# Altium schematic sheet demo_dermis_main_testboard_scratch.SchDoc
size A0
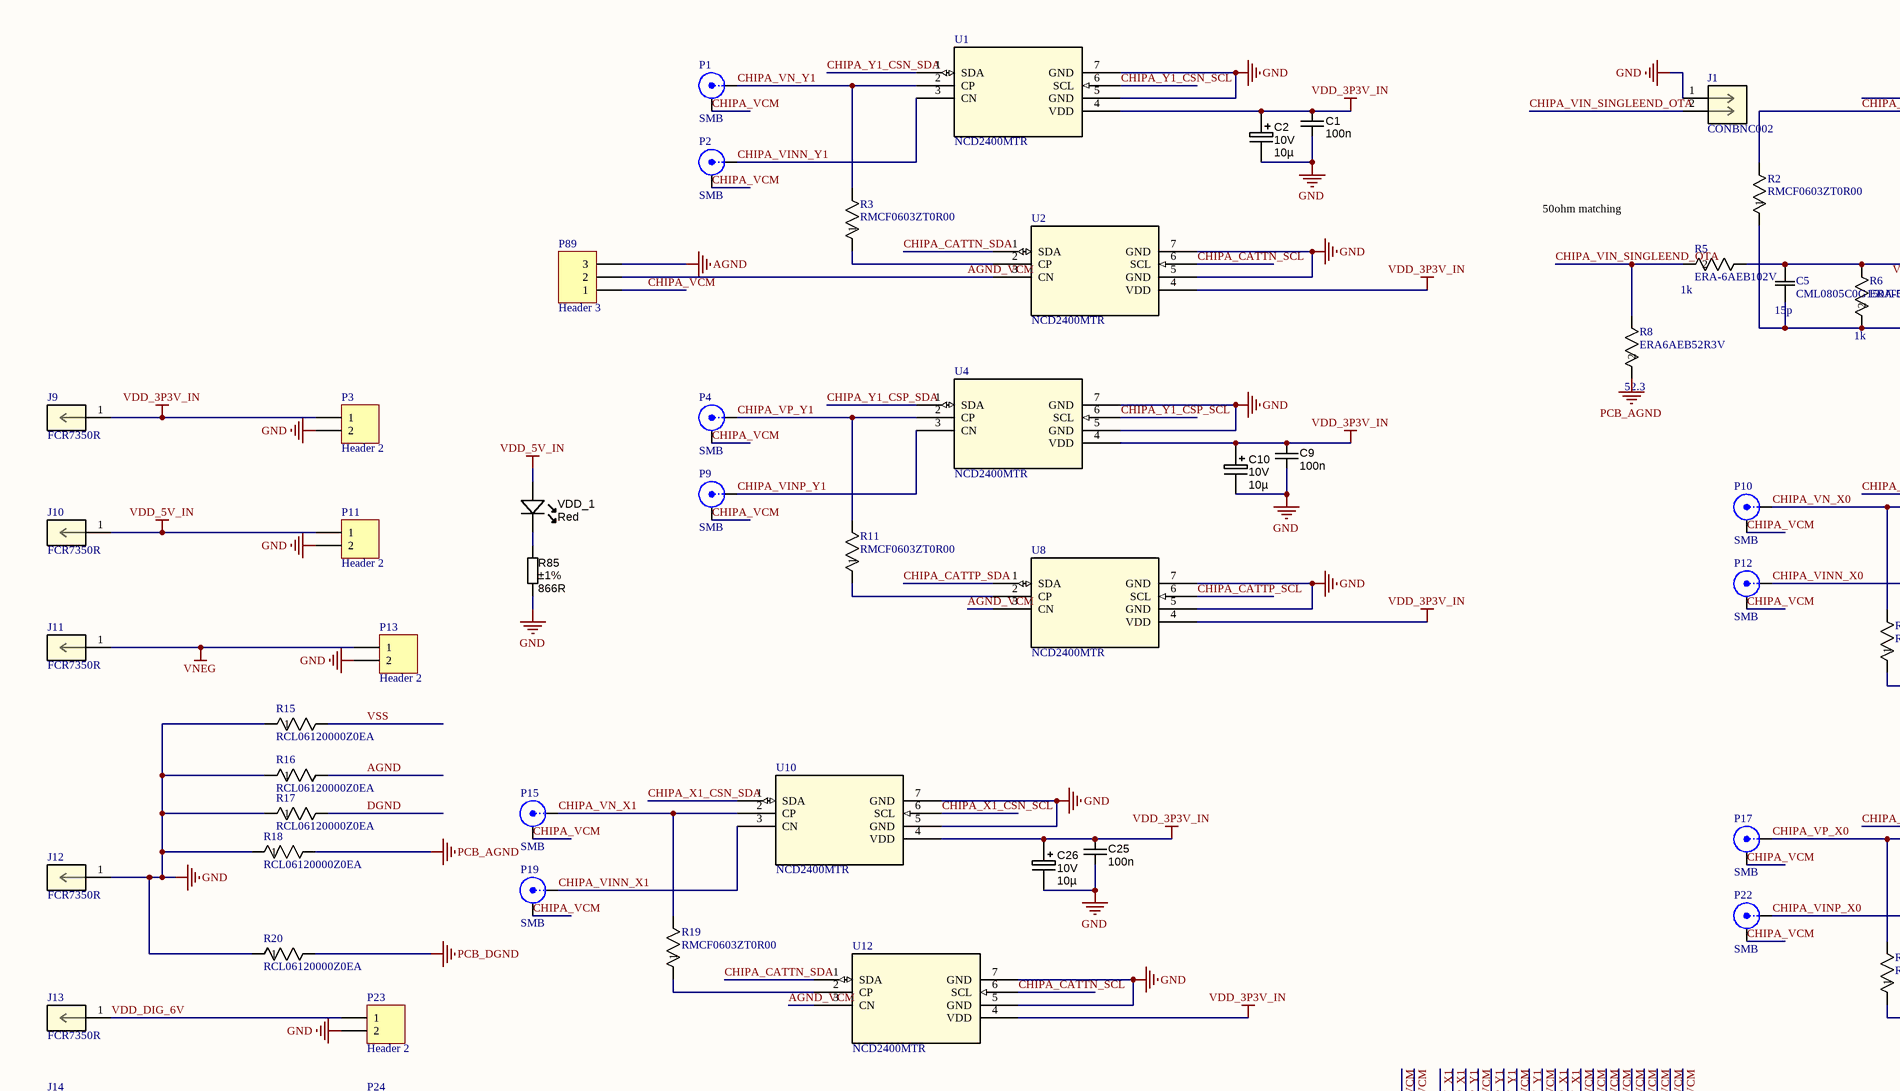
[diagram p0: demo_dermis_main_testboard_scratch.SchDoc, top left]
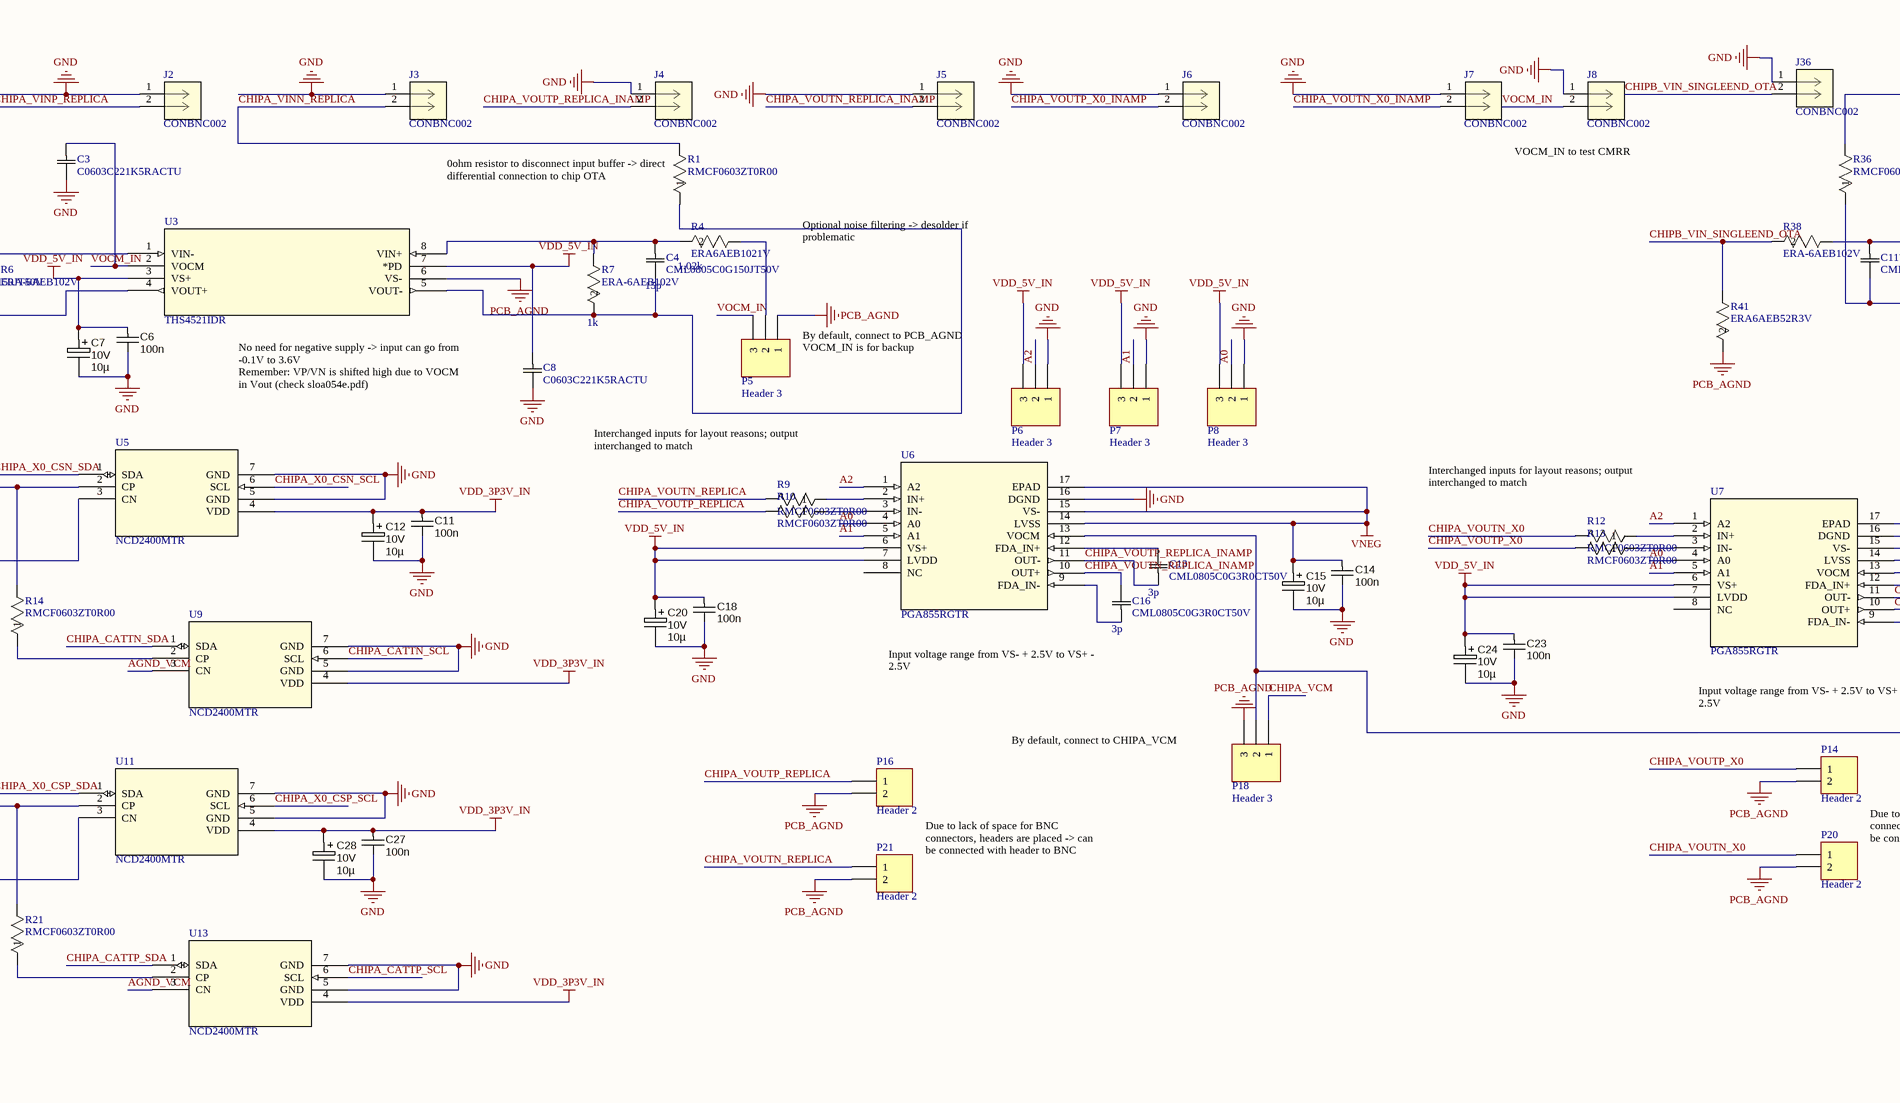
[diagram p1: demo_dermis_main_testboard_scratch.SchDoc, top middle]
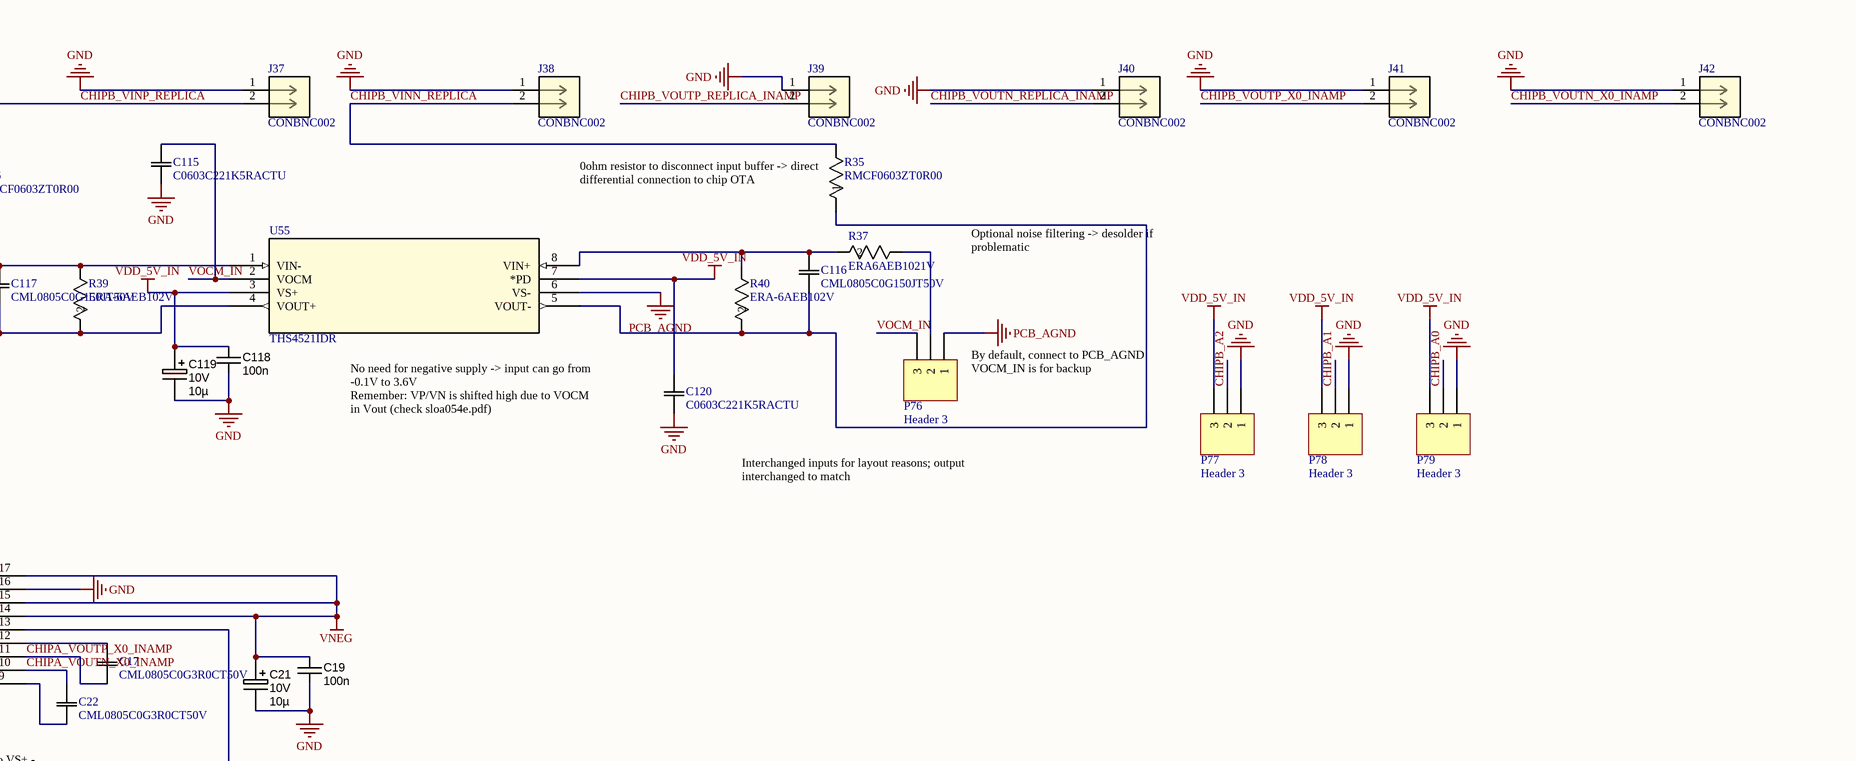
[diagram p2: demo_dermis_main_testboard_scratch.SchDoc, top right]
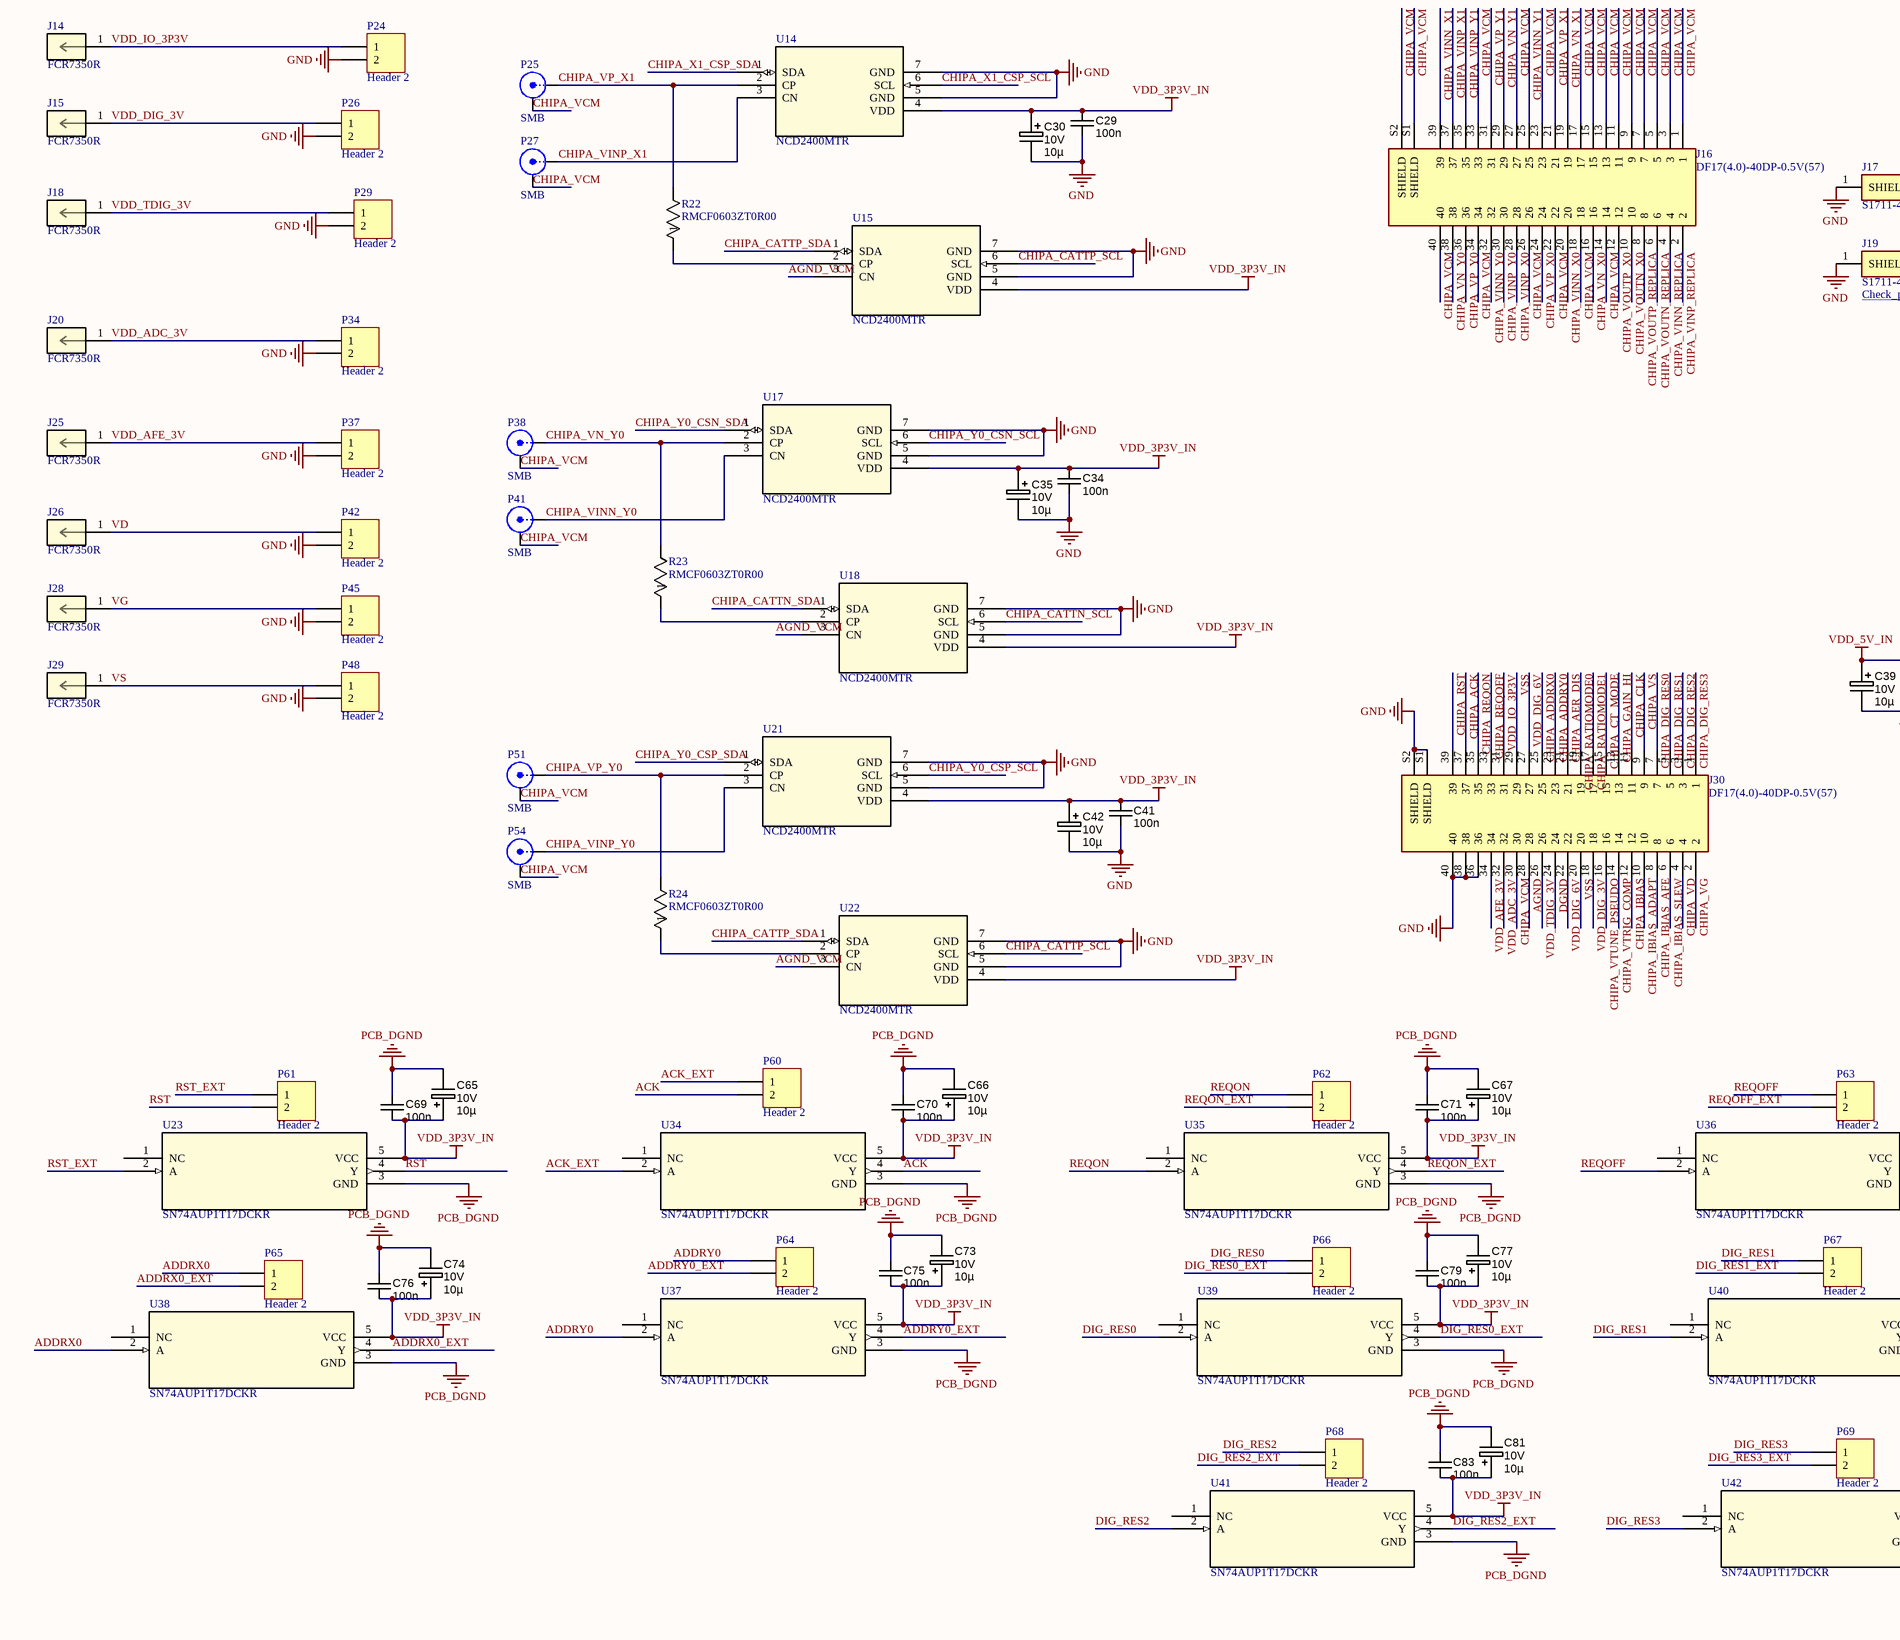
[diagram p3: demo_dermis_main_testboard_scratch.SchDoc, centre left]
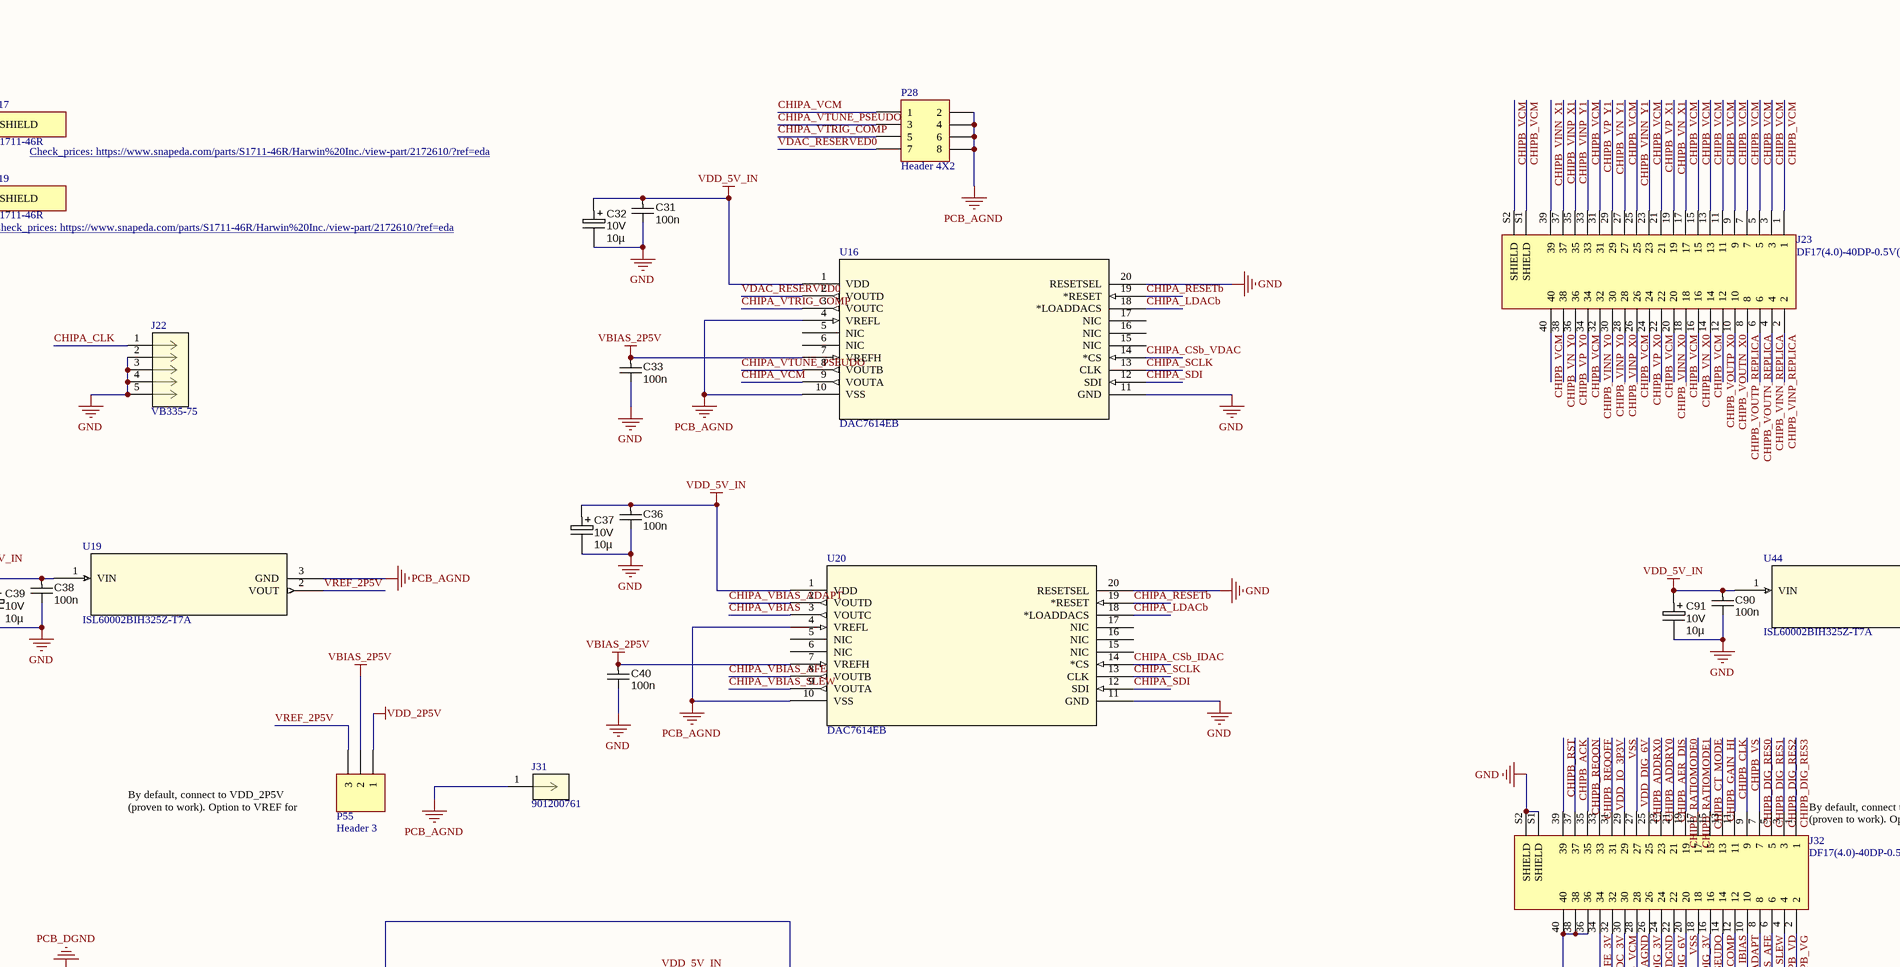
[diagram p4: demo_dermis_main_testboard_scratch.SchDoc, centre middle]
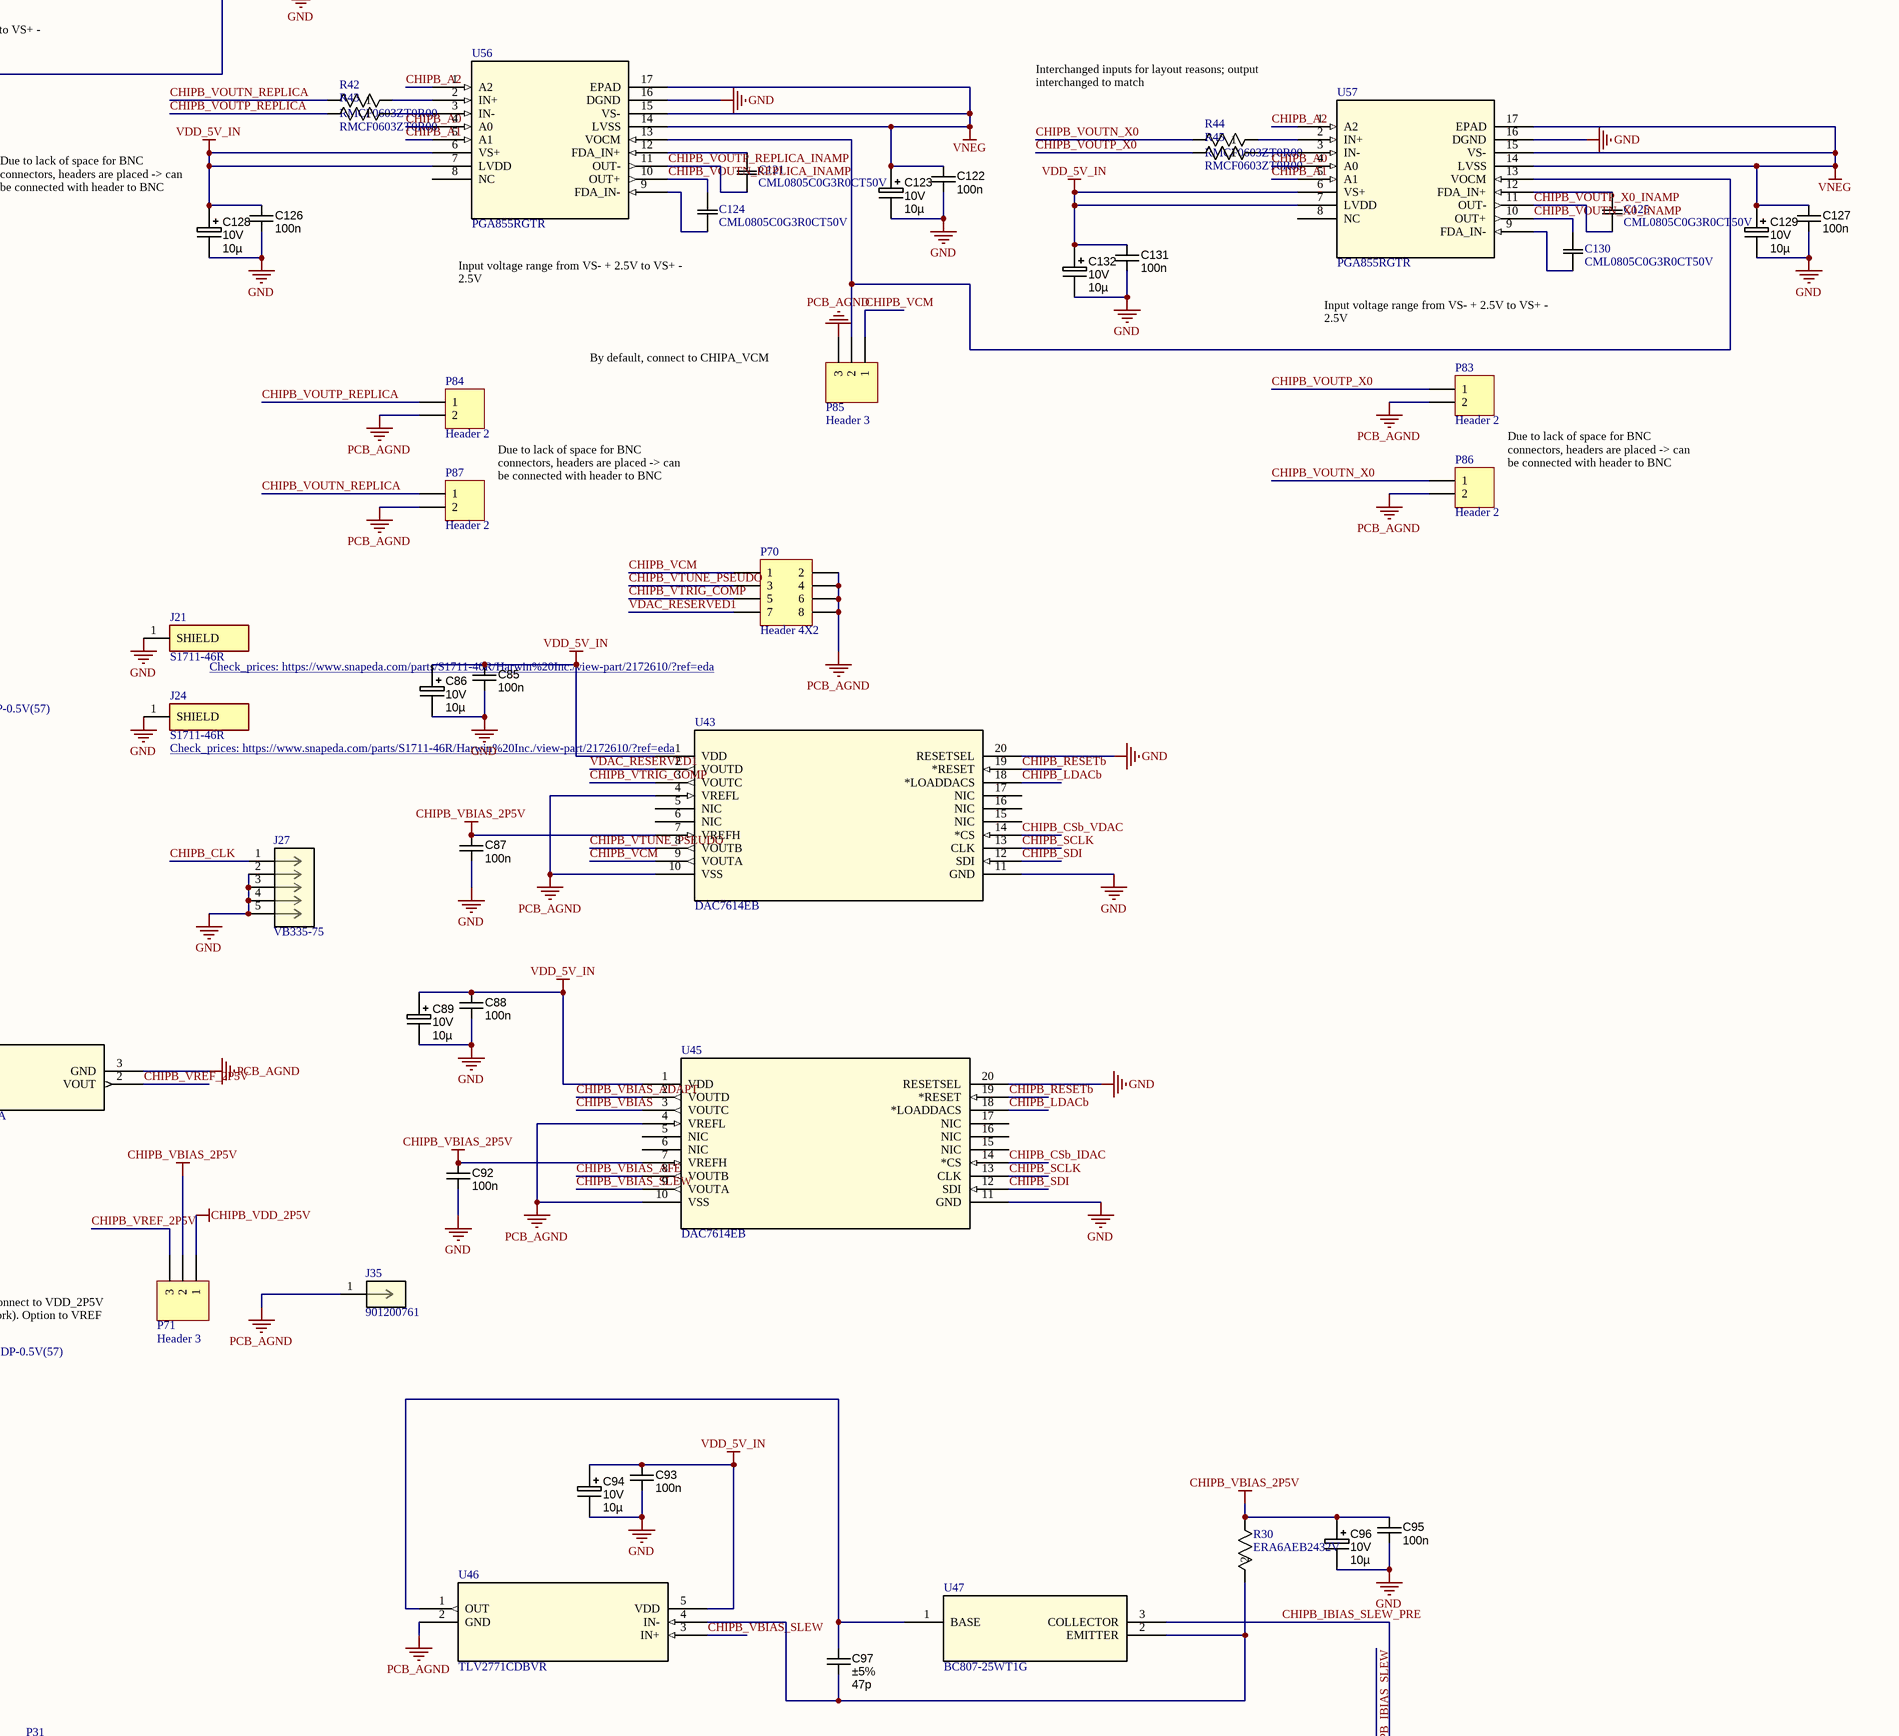
[diagram p5: demo_dermis_main_testboard_scratch.SchDoc, centre right]
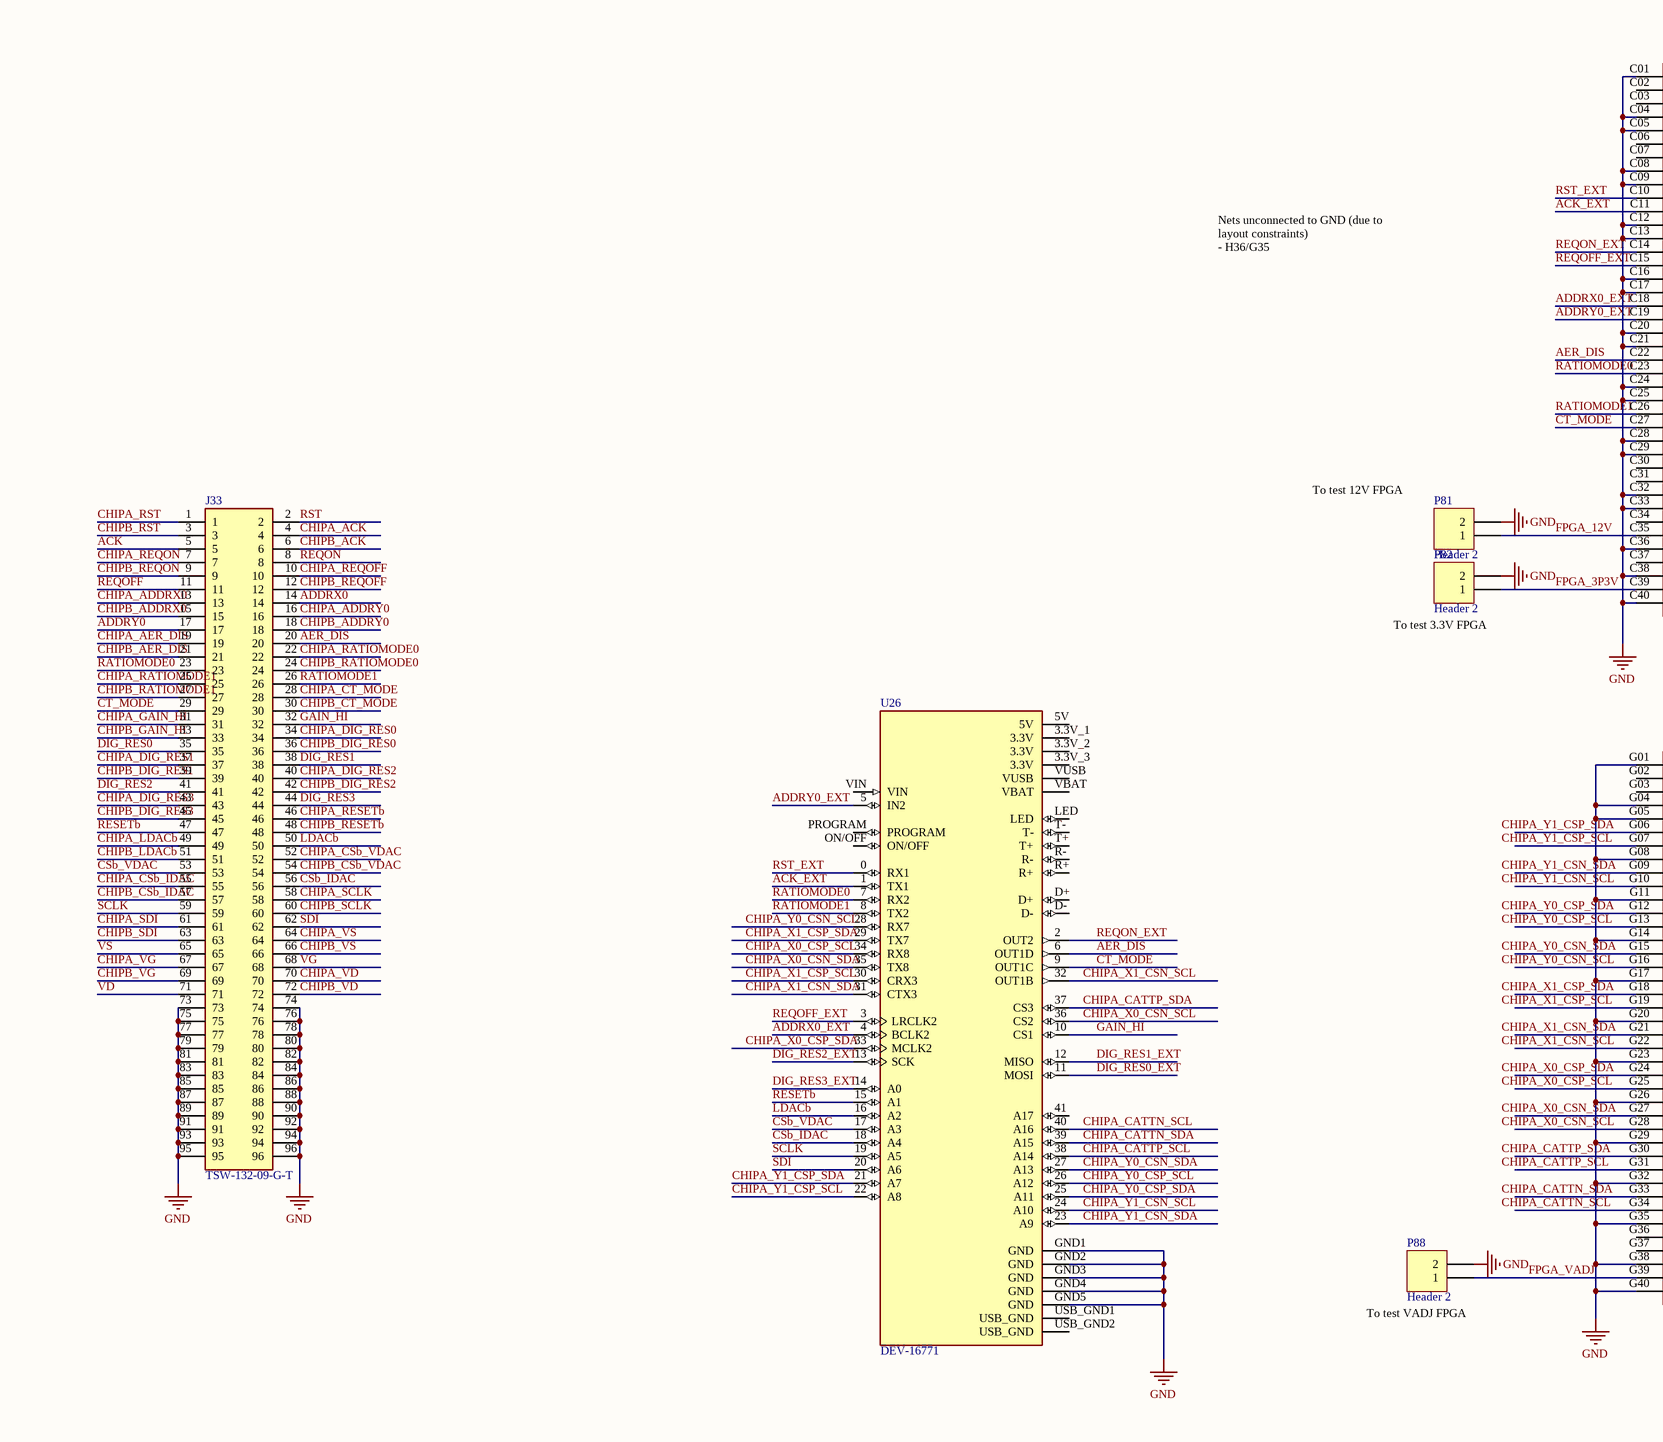
[diagram p6: demo_dermis_main_testboard_scratch.SchDoc, bottom left]
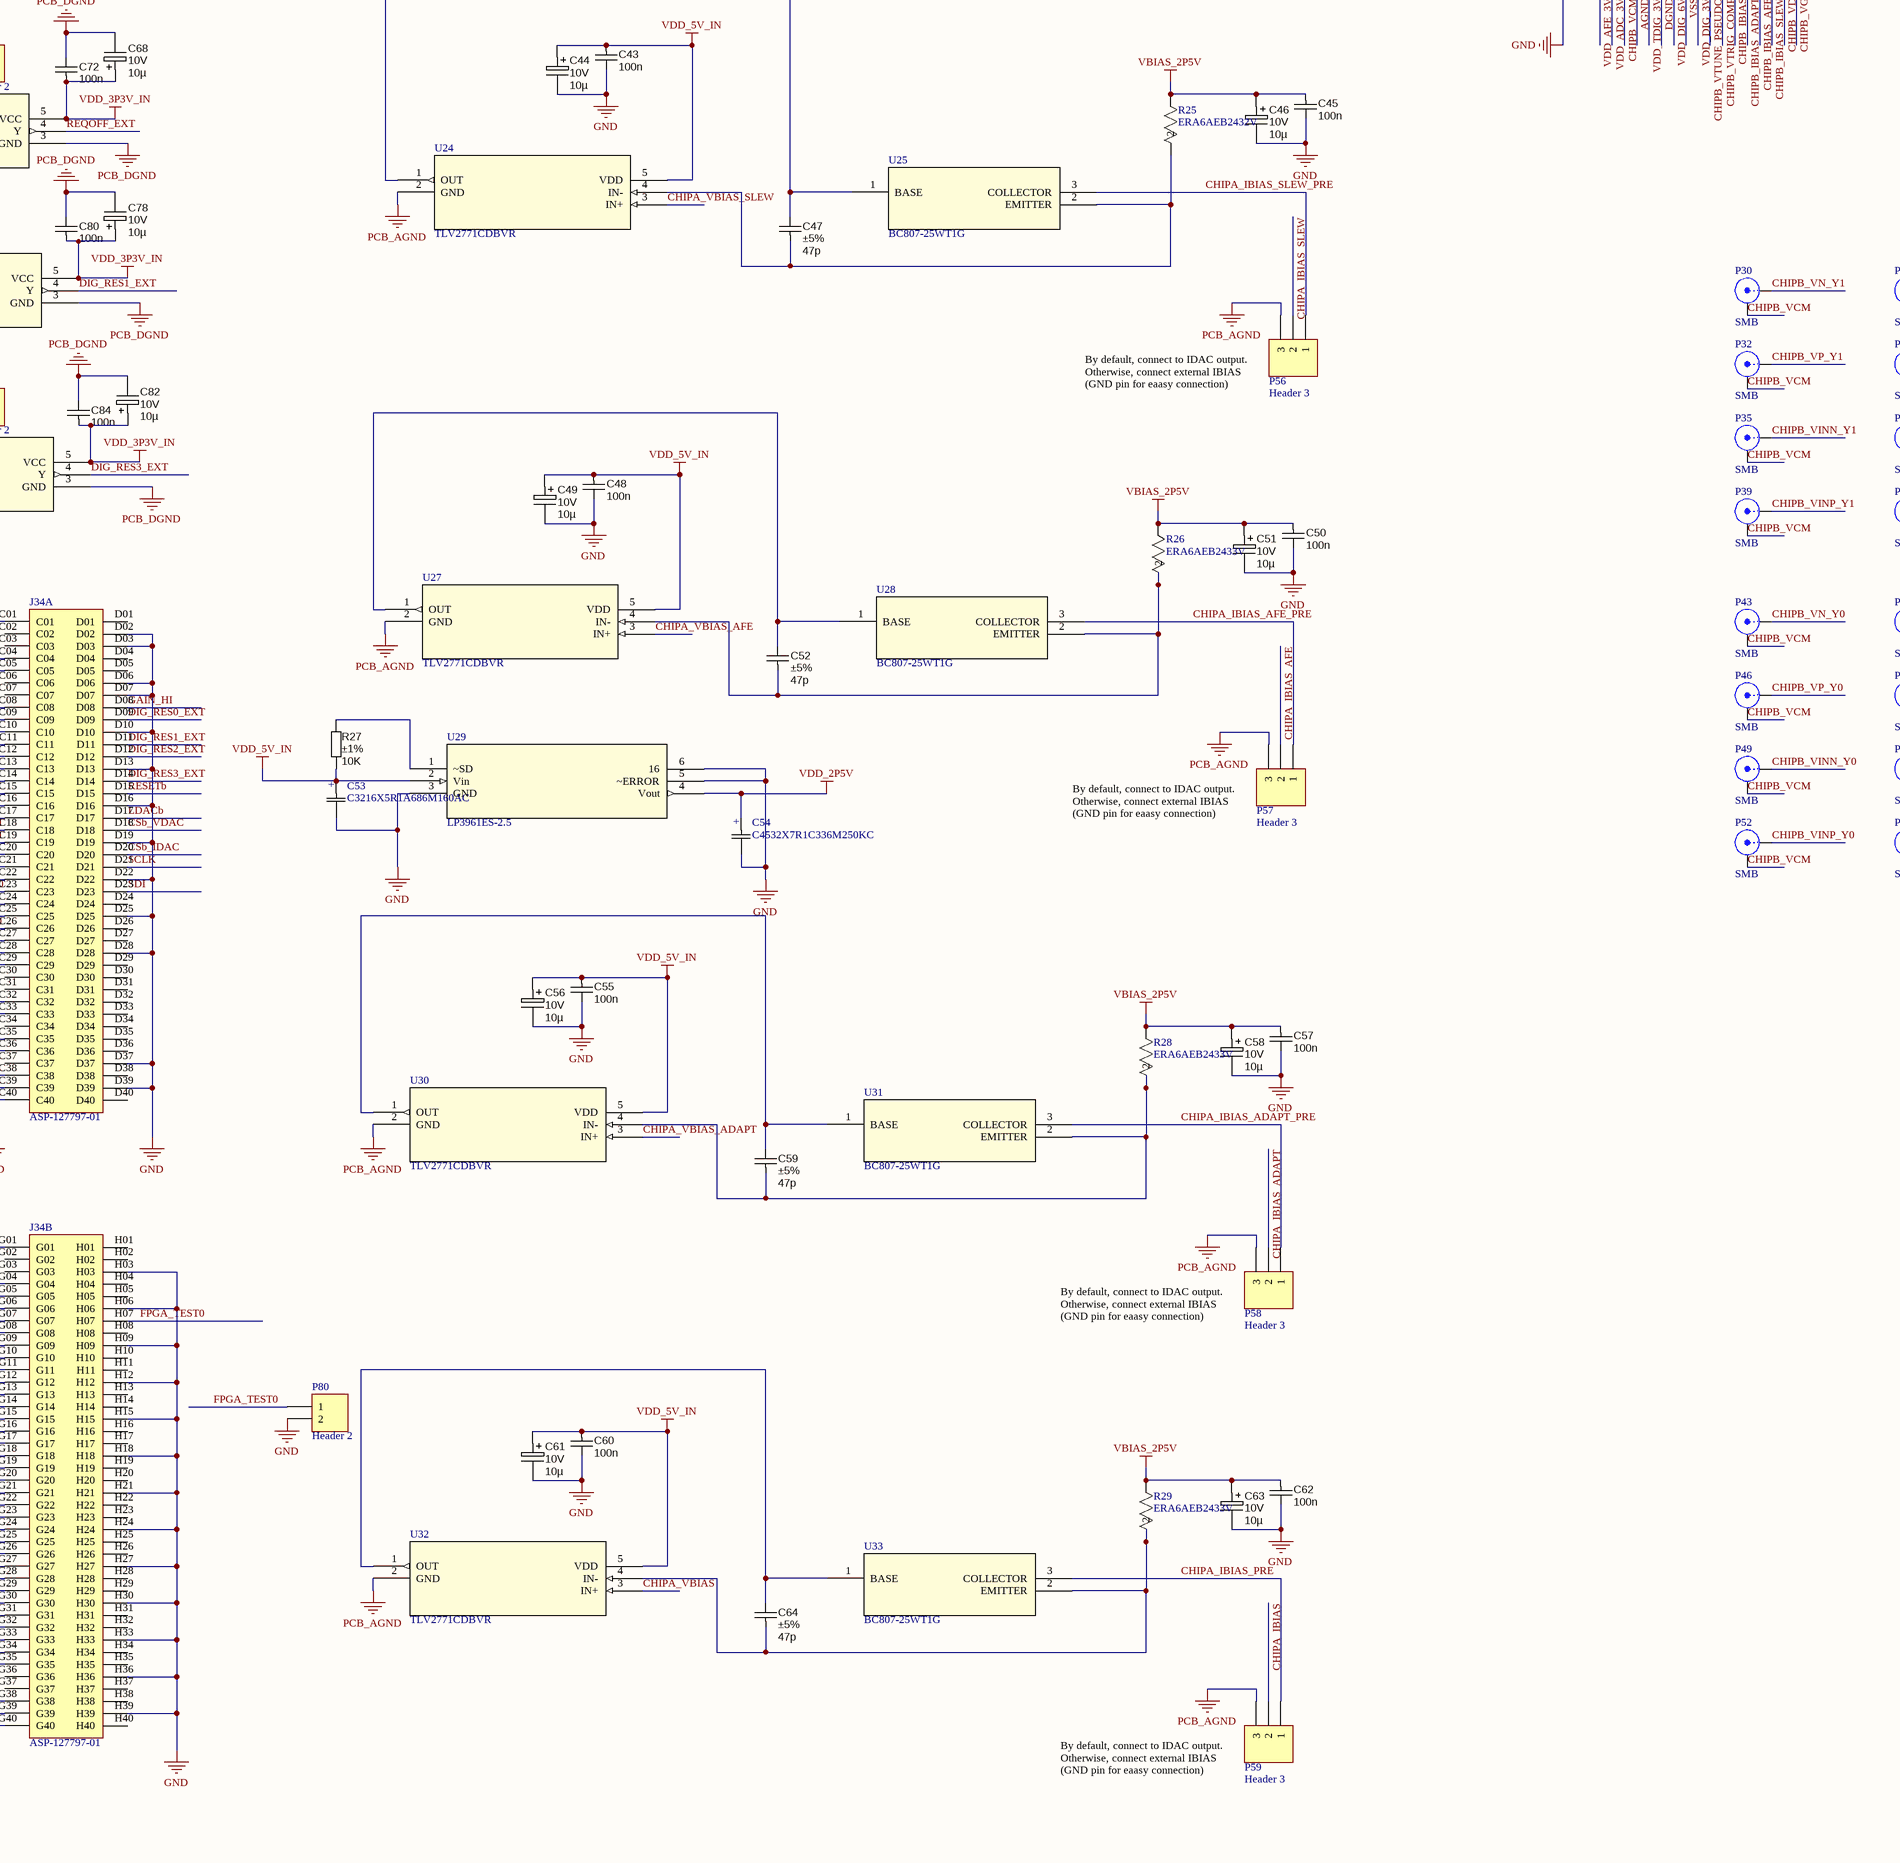
[diagram p7: demo_dermis_main_testboard_scratch.SchDoc, bottom middle]
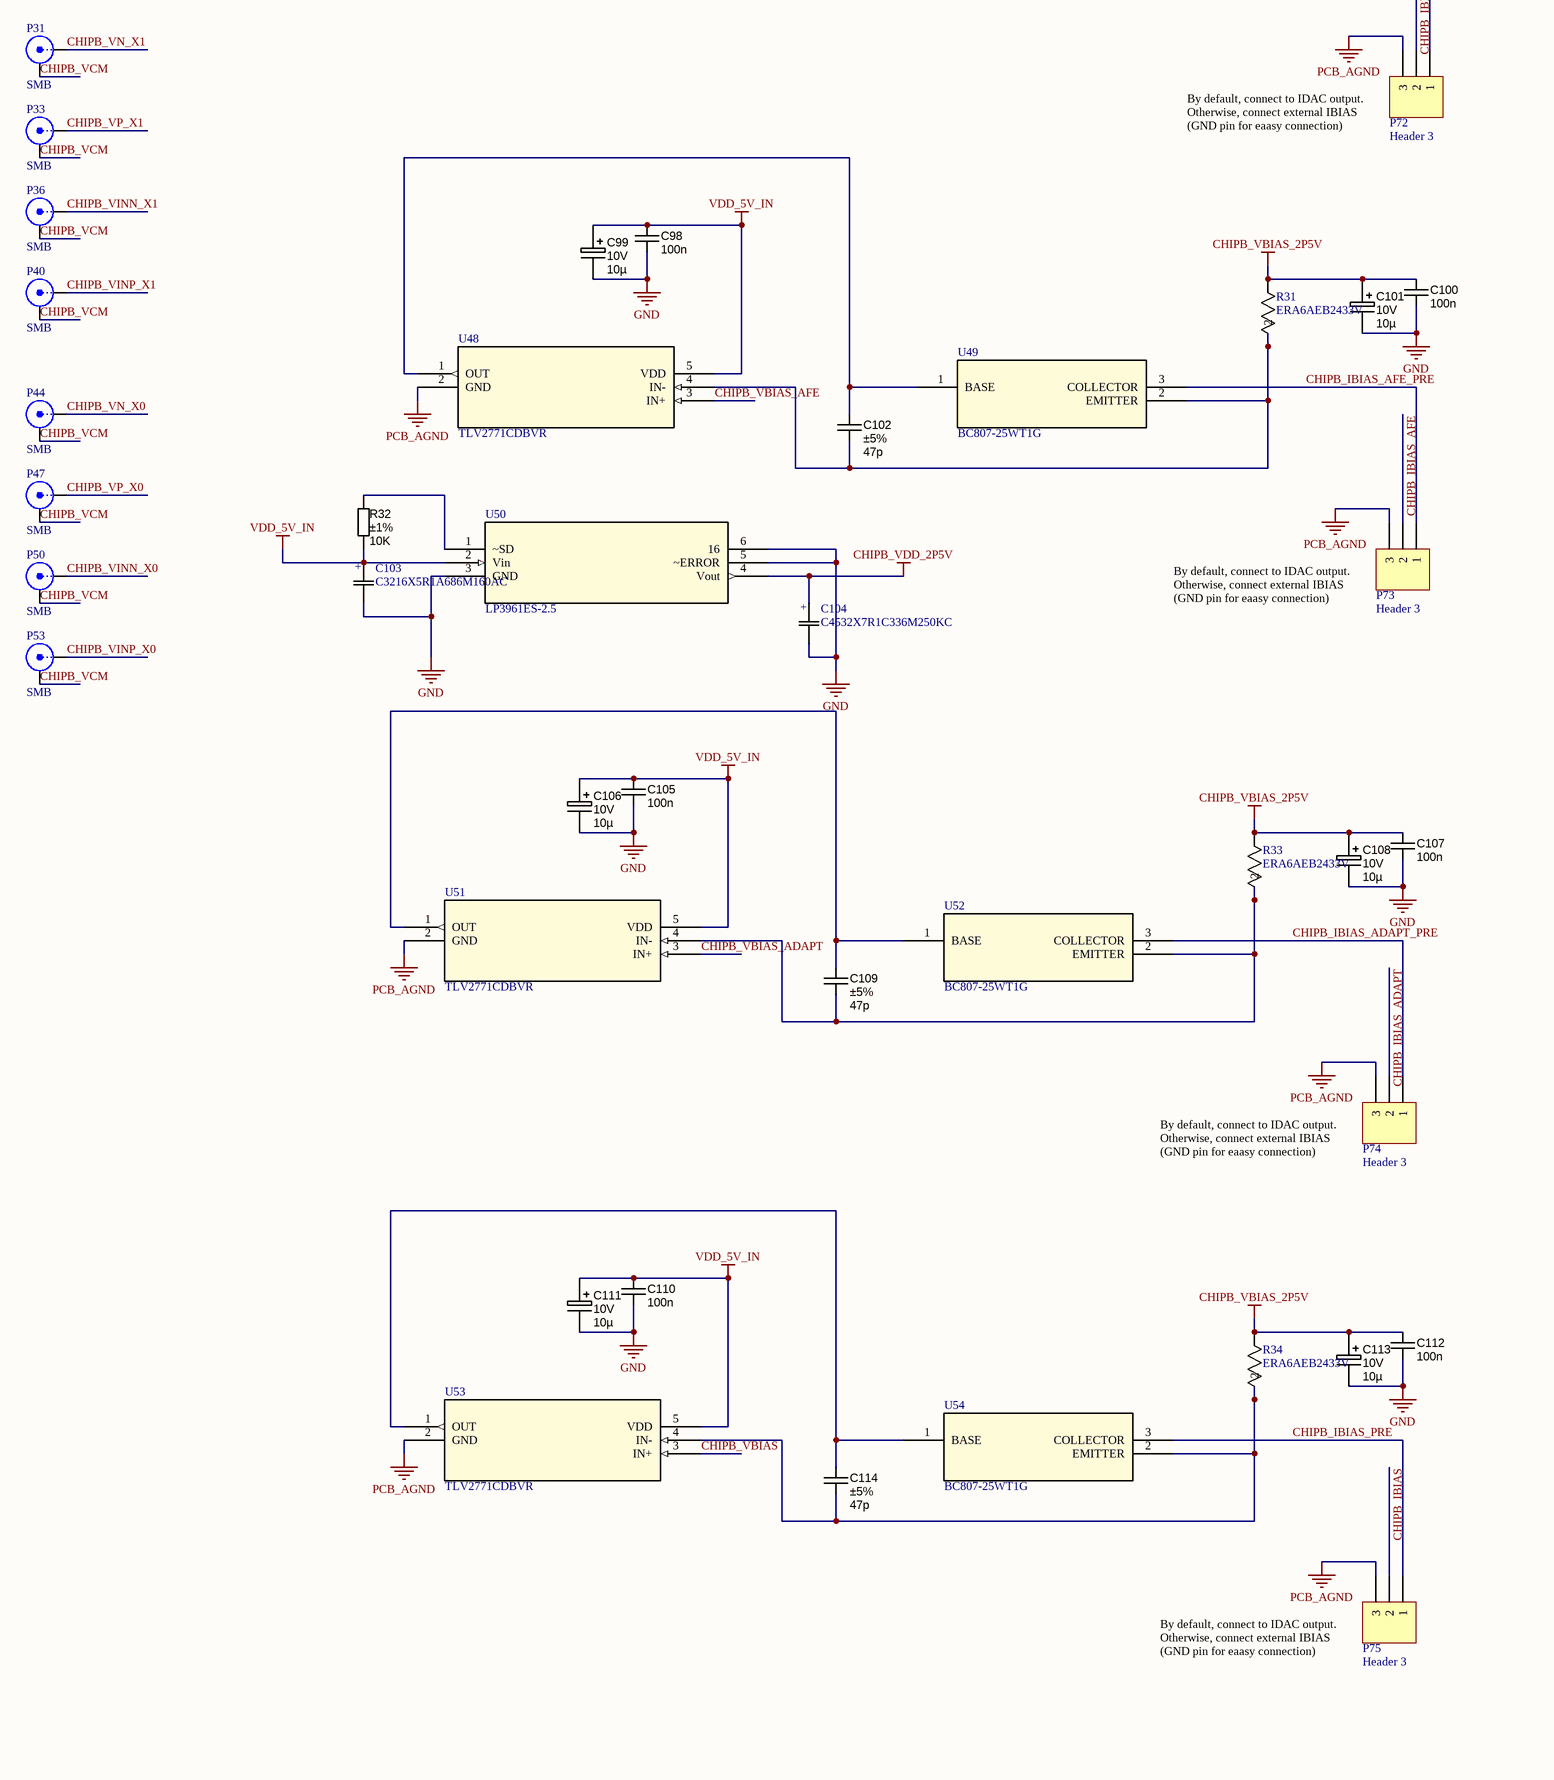
[diagram p8: demo_dermis_main_testboard_scratch.SchDoc, bottom right]

## Parts
C1  value 100n  [CAPC1608N]  (hidden comment: approved sub OK)
C2  Ratings: 10V  [CAPMP2012X150USR]  (hidden comment: 10µ)
C3  C0603C221K5RACTU  [CAPC17595_87N_KEM]
C4  CML0805C0G150JT50V  value 15p  [CAP_CML_0805_.3pF-1500pF,4700pF_STP]
C5  CML0805C0G150JT50V  value 15p  [CAP_CML_0805_.3pF-1500pF,4700pF_STP]
C6  value 100n  [CAPC1608N]  (hidden comment: approved sub OK)
C7  Ratings: 10V  [CAPMP2012X150USR]  (hidden comment: 10µ)
C8  C0603C221K5RACTU  [CAPC17595_87N_KEM]
C9  value 100n  [CAPC1608N]  (hidden comment: approved sub OK)
C10  Ratings: 10V  [CAPMP2012X150USR]  (hidden comment: 10µ)
C11  value 100n  [CAPC1608N]  (hidden comment: approved sub OK)
C12  Ratings: 10V  [CAPMP2012X150USR]  (hidden comment: 10µ)
C13  CML0805C0G3R0CT50V  value 3p  [CAP_CML_0805_.3pF-1500pF,4700pF_STP]
C14  value 100n  [CAPC1608N]  (hidden comment: approved sub OK)
C15  Ratings: 10V  [CAPMP2012X150USR]  (hidden comment: 10µ)
C16  CML0805C0G3R0CT50V  value 3p  [CAP_CML_0805_.3pF-1500pF,4700pF_STP]
C17  CML0805C0G3R0CT50V  [CAP_CML_0805_.3pF-1500pF,4700pF_STP]
C18  value 100n  [CAPC1608N]  (hidden comment: approved sub OK)
C19  value 100n  [CAPC1608N]  (hidden comment: approved sub OK)
C20  Ratings: 10V  [CAPMP2012X150USR]  (hidden comment: 10µ)
C21  Ratings: 10V  [CAPMP2012X150USR]  (hidden comment: 10µ)
C22  CML0805C0G3R0CT50V  [CAP_CML_0805_.3pF-1500pF,4700pF_STP]
C23  value 100n  [CAPC1608N]  (hidden comment: approved sub OK)
C24  Ratings: 10V  [CAPMP2012X150USR]  (hidden comment: 10µ)
C25  value 100n  [CAPC1608N]  (hidden comment: approved sub OK)
C26  Ratings: 10V  [CAPMP2012X150USR]  (hidden comment: 10µ)
C27  value 100n  [CAPC1608N]  (hidden comment: approved sub OK)
C28  Ratings: 10V  [CAPMP2012X150USR]  (hidden comment: 10µ)
C29  value 100n  [CAPC1608N]  (hidden comment: approved sub OK)
C30  Ratings: 10V  [CAPMP2012X150USR]  (hidden comment: 10µ)
C31  value 100n  [CAPC1608N]  (hidden comment: approved sub OK)
C32  Ratings: 10V  [CAPMP2012X150USR]  (hidden comment: 10µ)
C33  value 100n  [CAPC1608N]  (hidden comment: approved sub OK)
C34  value 100n  [CAPC1608N]  (hidden comment: approved sub OK)
C35  Ratings: 10V  [CAPMP2012X150USR]  (hidden comment: 10µ)
C36  value 100n  [CAPC1608N]  (hidden comment: approved sub OK)
C37  Ratings: 10V  [CAPMP2012X150USR]  (hidden comment: 10µ)
C38  value 100n  [CAPC1608N]  (hidden comment: approved sub OK)
C39  Ratings: 10V  [CAPMP2012X150USR]  (hidden comment: 10µ)
C40  value 100n  [CAPC1608N]  (hidden comment: approved sub OK)
C41  value 100n  [CAPC1608N]  (hidden comment: approved sub OK)
C42  Ratings: 10V  [CAPMP2012X150USR]  (hidden comment: 10µ)
C43  value 100n  [CAPC1608N]  (hidden comment: approved sub OK)
C44  Ratings: 10V  [CAPMP2012X150USR]  (hidden comment: 10µ)
C45  value 100n  [CAPC1608N]  (hidden comment: approved sub OK)
C46  Ratings: 10V  [CAPMP2012X150USR]  (hidden comment: 10µ)
C47  Tolerance: ±5%  [CAPC1608N]  (hidden comment: 47p)
C48  value 100n  [CAPC1608N]  (hidden comment: approved sub OK)
C49  Ratings: 10V  [CAPMP2012X150USR]  (hidden comment: 10µ)
C50  value 100n  [CAPC1608N]  (hidden comment: approved sub OK)
C51  Ratings: 10V  [CAPMP2012X150USR]  (hidden comment: 10µ)
C52  Tolerance: ±5%  [CAPC1608N]  (hidden comment: 47p)
C53  C3216X5R1A686M160AC  [CAP_3216_TDK]
C54  C4532X7R1C336M250KC  [CAP_4532_TDK]
C55  value 100n  [CAPC1608N]  (hidden comment: approved sub OK)
C56  Ratings: 10V  [CAPMP2012X150USR]  (hidden comment: 10µ)
C57  value 100n  [CAPC1608N]  (hidden comment: approved sub OK)
C58  Ratings: 10V  [CAPMP2012X150USR]  (hidden comment: 10µ)
C59  Tolerance: ±5%  [CAPC1608N]  (hidden comment: 47p)
C60  value 100n  [CAPC1608N]  (hidden comment: approved sub OK)
C61  Ratings: 10V  [CAPMP2012X150USR]  (hidden comment: 10µ)
C62  value 100n  [CAPC1608N]  (hidden comment: approved sub OK)
C63  Ratings: 10V  [CAPMP2012X150USR]  (hidden comment: 10µ)
C64  Tolerance: ±5%  [CAPC1608N]  (hidden comment: 47p)
C65  Ratings: 10V  [CAPMP2012X150USR]  (hidden comment: 10µ)
C66  Ratings: 10V  [CAPMP2012X150USR]  (hidden comment: 10µ)
C67  Ratings: 10V  [CAPMP2012X150USR]  (hidden comment: 10µ)
C68  Ratings: 10V  [CAPMP2012X150USR]  (hidden comment: 10µ)
C69  value 100n  [CAPC1608N]  (hidden comment: approved sub OK)
C70  value 100n  [CAPC1608N]  (hidden comment: approved sub OK)
C71  value 100n  [CAPC1608N]  (hidden comment: approved sub OK)
C72  value 100n  [CAPC1608N]  (hidden comment: approved sub OK)
C73  Ratings: 10V  [CAPMP2012X150USR]  (hidden comment: 10µ)
C74  Ratings: 10V  [CAPMP2012X150USR]  (hidden comment: 10µ)
C75  value 100n  [CAPC1608N]  (hidden comment: approved sub OK)
C76  value 100n  [CAPC1608N]  (hidden comment: approved sub OK)
C77  Ratings: 10V  [CAPMP2012X150USR]  (hidden comment: 10µ)
C78  Ratings: 10V  [CAPMP2012X150USR]  (hidden comment: 10µ)
C79  value 100n  [CAPC1608N]  (hidden comment: approved sub OK)
C80  value 100n  [CAPC1608N]  (hidden comment: approved sub OK)
C81  Ratings: 10V  [CAPMP2012X150USR]  (hidden comment: 10µ)
C82  Ratings: 10V  [CAPMP2012X150USR]  (hidden comment: 10µ)
C83  value 100n  [CAPC1608N]  (hidden comment: approved sub OK)
C84  value 100n  [CAPC1608N]  (hidden comment: approved sub OK)
C85  value 100n  [CAPC1608N]  (hidden comment: approved sub OK)
C86  Ratings: 10V  [CAPMP2012X150USR]  (hidden comment: 10µ)
C87  value 100n  [CAPC1608N]  (hidden comment: approved sub OK)
C88  value 100n  [CAPC1608N]  (hidden comment: approved sub OK)
C89  Ratings: 10V  [CAPMP2012X150USR]  (hidden comment: 10µ)
C90  value 100n  [CAPC1608N]  (hidden comment: approved sub OK)
C91  Ratings: 10V  [CAPMP2012X150USR]  (hidden comment: 10µ)
C92  value 100n  [CAPC1608N]  (hidden comment: approved sub OK)
C93  value 100n  [CAPC1608N]  (hidden comment: approved sub OK)
C94  Ratings: 10V  [CAPMP2012X150USR]  (hidden comment: 10µ)
C95  value 100n  [CAPC1608N]  (hidden comment: approved sub OK)
C96  Ratings: 10V  [CAPMP2012X150USR]  (hidden comment: 10µ)
C97  Tolerance: ±5%  [CAPC1608N]  (hidden comment: 47p)
C98  value 100n  [CAPC1608N]  (hidden comment: approved sub OK)
C99  Ratings: 10V  [CAPMP2012X150USR]  (hidden comment: 10µ)
C100  value 100n  [CAPC1608N]  (hidden comment: approved sub OK)
C101  Ratings: 10V  [CAPMP2012X150USR]  (hidden comment: 10µ)
C102  Tolerance: ±5%  [CAPC1608N]  (hidden comment: 47p)
C103  C3216X5R1A686M160AC  [CAP_3216_TDK]
C104  C4532X7R1C336M250KC  [CAP_4532_TDK]
C105  value 100n  [CAPC1608N]  (hidden comment: approved sub OK)
C106  Ratings: 10V  [CAPMP2012X150USR]  (hidden comment: 10µ)
C107  value 100n  [CAPC1608N]  (hidden comment: approved sub OK)
C108  Ratings: 10V  [CAPMP2012X150USR]  (hidden comment: 10µ)
C109  Tolerance: ±5%  [CAPC1608N]  (hidden comment: 47p)
C110  value 100n  [CAPC1608N]  (hidden comment: approved sub OK)
C111  Ratings: 10V  [CAPMP2012X150USR]  (hidden comment: 10µ)
C112  value 100n  [CAPC1608N]  (hidden comment: approved sub OK)
C113  Ratings: 10V  [CAPMP2012X150USR]  (hidden comment: 10µ)
C114  Tolerance: ±5%  [CAPC1608N]  (hidden comment: 47p)
C115  C0603C221K5RACTU  [CAPC17595_87N_KEM]
C116  CML0805C0G150JT50V  [CAP_CML_0805_.3pF-1500pF,4700pF_STP]
C117  CML0805C0G150JT50V  [CAP_CML_0805_.3pF-1500pF,4700pF_STP]
C118  value 100n  [CAPC1608N]  (hidden comment: approved sub OK)
C119  Ratings: 10V  [CAPMP2012X150USR]  (hidden comment: 10µ)
C120  C0603C221K5RACTU  [CAPC17595_87N_KEM]
C121  CML0805C0G3R0CT50V  [CAP_CML_0805_.3pF-1500pF,4700pF_STP]
C122  value 100n  [CAPC1608N]  (hidden comment: approved sub OK)
C123  Ratings: 10V  [CAPMP2012X150USR]  (hidden comment: 10µ)
C124  CML0805C0G3R0CT50V  [CAP_CML_0805_.3pF-1500pF,4700pF_STP]
C125  CML0805C0G3R0CT50V  [CAP_CML_0805_.3pF-1500pF,4700pF_STP]
C126  value 100n  [CAPC1608N]  (hidden comment: approved sub OK)
C127  value 100n  [CAPC1608N]  (hidden comment: approved sub OK)
C128  Ratings: 10V  [CAPMP2012X150USR]  (hidden comment: 10µ)
C129  Ratings: 10V  [CAPMP2012X150USR]  (hidden comment: 10µ)
C130  CML0805C0G3R0CT50V  [CAP_CML_0805_.3pF-1500pF,4700pF_STP]
C131  value 100n  [CAPC1608N]  (hidden comment: approved sub OK)
C132  Ratings: 10V  [CAPMP2012X150USR]  (hidden comment: 10µ)
J1  CONBNC002  [CONN_CONBN_LNX]
J2  CONBNC002  [CONN_CONBN_LNX]
J3  CONBNC002  [CONN_CONBN_LNX]
J4  CONBNC002  [CONN_CONBN_LNX]
J5  CONBNC002  [CONN_CONBN_LNX]
J6  CONBNC002  [CONN_CONBN_LNX]
J7  CONBNC002  [CONN_CONBN_LNX]
J8  CONBNC002  [CONN_CONBN_LNX]
J9  FCR7350R  [CONN1_FCR7350R_CLF]
J10  FCR7350R  [CONN1_FCR7350R_CLF]
J11  FCR7350R  [CONN1_FCR7350R_CLF]
J12  FCR7350R  [CONN1_FCR7350R_CLF]
J13  FCR7350R  [CONN1_FCR7350R_CLF]
J14  FCR7350R  [CONN1_FCR7350R_CLF]
J15  FCR7350R  [CONN1_FCR7350R_CLF]
J16  DF17(4.0)-40DP-0.5V(57)  [HRS_DF17(4.0)-40DP-0.5V(57)]
J17  S1711-46R  [HARWIN_S1711-46R]
J18  FCR7350R  [CONN1_FCR7350R_CLF]
J19  S1711-46R  [HARWIN_S1711-46R]
J20  FCR7350R  [CONN1_FCR7350R_CLF]
J21  S1711-46R  [HARWIN_S1711-46R]
J22  VB335-75  [CONN5_VB335_CIN]
J23  DF17(4.0)-40DP-0.5V(57)  [HRS_DF17(4.0)-40DP-0.5V(57)]
J24  S1711-46R  [HARWIN_S1711-46R]
J25  FCR7350R  [CONN1_FCR7350R_CLF]
J26  FCR7350R  [CONN1_FCR7350R_CLF]
J27  VB335-75  [CONN5_VB335_CIN]
J28  FCR7350R  [CONN1_FCR7350R_CLF]
J29  FCR7350R  [CONN1_FCR7350R_CLF]
J30  DF17(4.0)-40DP-0.5V(57)  [HRS_DF17(4.0)-40DP-0.5V(57)]
J31  901200761  [CONN_90120-0761_MOL]
J32  DF17(4.0)-40DP-0.5V(57)  [HRS_DF17(4.0)-40DP-0.5V(57)]
J33  TSW-132-09-G-T  [HDRV96W64P254_3X32_8128X749X838P]
J34  ASP-127797-01  [SAMTEC_ASP-127797-01]  (parts A,B of 2)
J35  901200761  [CONN_90120-0761_MOL]
J36  CONBNC002  [CONN_CONBN_LNX]
J37  CONBNC002  [CONN_CONBN_LNX]
J38  CONBNC002  [CONN_CONBN_LNX]
J39  CONBNC002  [CONN_CONBN_LNX]
J40  CONBNC002  [CONN_CONBN_LNX]
J41  CONBNC002  [CONN_CONBN_LNX]
J42  CONBNC002  [CONN_CONBN_LNX]
P1  SMB  [SMB_V-RJ45]
P2  SMB  [SMB_V-RJ45]
P3  Header 2  [HDR1X2]
P4  SMB  [SMB_V-RJ45]
P5  Header 3  [HDR1X3]
P6  Header 3  [HDR1X3]
P7  Header 3  [HDR1X3]
P8  Header 3  [HDR1X3]
P9  SMB  [SMB_V-RJ45]
P10  SMB  [SMB_V-RJ45]
P11  Header 2  [HDR1X2]
P12  SMB  [SMB_V-RJ45]
P13  Header 2  [HDR1X2]
P14  Header 2  [HDR1X2]
P15  SMB  [SMB_V-RJ45]
P16  Header 2  [HDR1X2]
P17  SMB  [SMB_V-RJ45]
P18  Header 3  [HDR1X3]
P19  SMB  [SMB_V-RJ45]
P20  Header 2  [HDR1X2]
P21  Header 2  [HDR1X2]
P22  SMB  [SMB_V-RJ45]
P23  Header 2  [HDR1X2]
P24  Header 2  [HDR1X2]
P25  SMB  [SMB_V-RJ45]
P26  Header 2  [HDR1X2]
P27  SMB  [SMB_V-RJ45]
P28  Header 4X2  [HDR2X4]
P29  Header 2  [HDR1X2]
P30  SMB  [SMB_V-RJ45]
P31  SMB  [SMB_V-RJ45]
P32  SMB  [SMB_V-RJ45]
P33  SMB  [SMB_V-RJ45]
P34  Header 2  [HDR1X2]
P35  SMB  [SMB_V-RJ45]
P36  SMB  [SMB_V-RJ45]
P37  Header 2  [HDR1X2]
P38  SMB  [SMB_V-RJ45]
P39  SMB  [SMB_V-RJ45]
P40  SMB  [SMB_V-RJ45]
P41  SMB  [SMB_V-RJ45]
P42  Header 2  [HDR1X2]
P43  SMB  [SMB_V-RJ45]
P44  SMB  [SMB_V-RJ45]
P45  Header 2  [HDR1X2]
P46  SMB  [SMB_V-RJ45]
P47  SMB  [SMB_V-RJ45]
P48  Header 2  [HDR1X2]
P49  SMB  [SMB_V-RJ45]
P50  SMB  [SMB_V-RJ45]
P51  SMB  [SMB_V-RJ45]
P52  SMB  [SMB_V-RJ45]
P53  SMB  [SMB_V-RJ45]
P54  SMB  [SMB_V-RJ45]
P55  Header 3  [HDR1X3]
P56  Header 3  [HDR1X3]
P57  Header 3  [HDR1X3]
P58  Header 3  [HDR1X3]
P59  Header 3  [HDR1X3]
P60  Header 2  [HDR1X2]
P61  Header 2  [HDR1X2]
P62  Header 2  [HDR1X2]
P63  Header 2  [HDR1X2]
P64  Header 2  [HDR1X2]
P65  Header 2  [HDR1X2]
P66  Header 2  [HDR1X2]
P67  Header 2  [HDR1X2]
P68  Header 2  [HDR1X2]
P69  Header 2  [HDR1X2]
P70  Header 4X2  [HDR2X4]
P71  Header 3  [HDR1X3]
P72  Header 3  [HDR1X3]
P73  Header 3  [HDR1X3]
P74  Header 3  [HDR1X3]
P75  Header 3  [HDR1X3]
P76  Header 3  [HDR1X3]
P77  Header 3  [HDR1X3]
P78  Header 3  [HDR1X3]
P79  Header 3  [HDR1X3]
P80  Header 2  [HDR1X2]
P81  Header 2  [HDR1X2]
P82  Header 2  [HDR1X2]
P83  Header 2  [HDR1X2]
P84  Header 2  [HDR1X2]
P85  Header 3  [HDR1X3]
P86  Header 2  [HDR1X2]
P87  Header 2  [HDR1X2]
P88  Header 2  [HDR1X2]
P89  Header 3  [HDR1X3]
R1  RMCF0603ZT0R00  [STA_RMCF0603_STP]
R2  RMCF0603ZT0R00  [STA_RMCF0603_STP]
R3  RMCF0603ZT0R00  [STA_RMCF0603_STP]
R4  ERA6AEB1021V  value 1.02k  [RES_ERA6A_0805_PAN]
R5  ERA-6AEB102V  value 1k  [RC0805N_PAN]
R6  ERA-6AEB102V  value 1k  [RC0805N_PAN]
R7  ERA-6AEB102V  value 1k  [RC0805N_PAN]
R8  ERA6AEB52R3V  value 52.3  [RES_ERA6A_0805_PAN]
R9  RMCF0603ZT0R00  [STA_RMCF0603_STP]
R10  RMCF0603ZT0R00  [STA_RMCF0603_STP]
R11  RMCF0603ZT0R00  [STA_RMCF0603_STP]
R12  RMCF0603ZT0R00  [STA_RMCF0603_STP]
R13  RMCF0603ZT0R00  [STA_RMCF0603_STP]
R14  RMCF0603ZT0R00  [STA_RMCF0603_STP]
R15  RCL06120000Z0EA  [RCL0612_VIS]
R16  RCL06120000Z0EA  [RCL0612_VIS]
R17  RCL06120000Z0EA  [RCL0612_VIS]
R18  RCL06120000Z0EA  [RCL0612_VIS]
R19  RMCF0603ZT0R00  [STA_RMCF0603_STP]
R20  RCL06120000Z0EA  [RCL0612_VIS]
R21  RMCF0603ZT0R00  [STA_RMCF0603_STP]
R22  RMCF0603ZT0R00  [STA_RMCF0603_STP]
R23  RMCF0603ZT0R00  [STA_RMCF0603_STP]
R24  RMCF0603ZT0R00  [STA_RMCF0603_STP]
R25  ERA6AEB2432V  [RES_ERA6A_0805_PAN]
R26  ERA6AEB2433V  [RES_ERA6A_0805_PAN]
R27  value 10K  Tolerance: ±1%  [RESC1608N]  (hidden comment: Thick Film)
R28  ERA6AEB2433V  [RES_ERA6A_0805_PAN]
R29  ERA6AEB2433V  [RES_ERA6A_0805_PAN]
R30  ERA6AEB2432V  [RES_ERA6A_0805_PAN]
R31  ERA6AEB2433V  [RES_ERA6A_0805_PAN]
R32  value 10K  Tolerance: ±1%  [RESC1608N]  (hidden comment: Thick Film)
R33  ERA6AEB2433V  [RES_ERA6A_0805_PAN]
R34  ERA6AEB2433V  [RES_ERA6A_0805_PAN]
R35  RMCF0603ZT0R00  [STA_RMCF0603_STP]
R36  RMCF0603ZT0R00  [STA_RMCF0603_STP]
R37  ERA6AEB1021V  [RES_ERA6A_0805_PAN]
R38  ERA-6AEB102V  [RC0805N_PAN]
R39  ERA-6AEB102V  [RC0805N_PAN]
R40  ERA-6AEB102V  [RC0805N_PAN]
R41  ERA6AEB52R3V  [RES_ERA6A_0805_PAN]
R42  RMCF0603ZT0R00  [STA_RMCF0603_STP]
R43  RMCF0603ZT0R00  [STA_RMCF0603_STP]
R44  RMCF0603ZT0R00  [STA_RMCF0603_STP]
R45  RMCF0603ZT0R00  [STA_RMCF0603_STP]
R85  value 866R  Tolerance: ±1%  [RESC1608N]  (hidden comment: Thick Film)
U1  NCD2400MTR  [DFN-6_IXY]
U2  NCD2400MTR  [DFN-6_IXY]
U3  THS4521IDR  [D8]
U4  NCD2400MTR  [DFN-6_IXY]
U5  NCD2400MTR  [DFN-6_IXY]
U6  PGA855RGTR  [VQFN16_RGT_TEX]
U7  PGA855RGTR  [VQFN16_RGT_TEX]
U8  NCD2400MTR  [DFN-6_IXY]
U9  NCD2400MTR  [DFN-6_IXY]
U10  NCD2400MTR  [DFN-6_IXY]
U11  NCD2400MTR  [DFN-6_IXY]
U12  NCD2400MTR  [DFN-6_IXY]
U13  NCD2400MTR  [DFN-6_IXY]
U14  NCD2400MTR  [DFN-6_IXY]
U15  NCD2400MTR  [DFN-6_IXY]
U16  DAC7614EB  [DB20]
U17  NCD2400MTR  [DFN-6_IXY]
U18  NCD2400MTR  [DFN-6_IXY]
U19  ISL60002BIH325Z-T7A  [P3_064_INR]
U20  DAC7614EB  [DB20]
U21  NCD2400MTR  [DFN-6_IXY]
U22  NCD2400MTR  [DFN-6_IXY]
U23  SN74AUP1T17DCKR  [DCK5]
U24  TLV2771CDBVR  [DBV5]
U25  BC807-25WT1G  [SOT-323-3_2P2X1P35_ONS]
U26  DEV-16771  [MODULE_DEV-16771]
U27  TLV2771CDBVR  [DBV5]
U28  BC807-25WT1G  [SOT-323-3_2P2X1P35_ONS]
U29  LP3961ES-2.5  [TS5B_TEX]
U30  TLV2771CDBVR  [DBV5]
U31  BC807-25WT1G  [SOT-323-3_2P2X1P35_ONS]
U32  TLV2771CDBVR  [DBV5]
U33  BC807-25WT1G  [SOT-323-3_2P2X1P35_ONS]
U34  SN74AUP1T17DCKR  [DCK5]
U35  SN74AUP1T17DCKR  [DCK5]
U36  SN74AUP1T17DCKR  [DCK5]
U37  SN74AUP1T17DCKR  [DCK5]
U38  SN74AUP1T17DCKR  [DCK5]
U39  SN74AUP1T17DCKR  [DCK5]
U40  SN74AUP1T17DCKR  [DCK5]
U41  SN74AUP1T17DCKR  [DCK5]
U42  SN74AUP1T17DCKR  [DCK5]
U43  DAC7614EB  [DB20]
U44  ISL60002BIH325Z-T7A  [P3_064_INR]
U45  DAC7614EB  [DB20]
U46  TLV2771CDBVR  [DBV5]
U47  BC807-25WT1G  [SOT-323-3_2P2X1P35_ONS]
U48  TLV2771CDBVR  [DBV5]
U49  BC807-25WT1G  [SOT-323-3_2P2X1P35_ONS]
U50  LP3961ES-2.5  [TS5B_TEX]
U51  TLV2771CDBVR  [DBV5]
U52  BC807-25WT1G  [SOT-323-3_2P2X1P35_ONS]
U53  TLV2771CDBVR  [DBV5]
U54  BC807-25WT1G  [SOT-323-3_2P2X1P35_ONS]
U55  THS4521IDR  [D8]
U56  PGA855RGTR  [VQFN16_RGT_TEX]
U57  PGA855RGTR  [VQFN16_RGT_TEX]
VDD_1  Red  [LED-0603-RED]

## Nets
AGND: J30.28 J32.28 P89.3 R16.2
CHIPB_VBIAS_2P5V: C87.1 C92.1 C95.1 C96.1 C100.1 C101.1 C107.1 C108.1 C112.1 C113.1 P71.2 R30.1 R31.1 R33.1 R34.1 U43.7(VREFH) U45.7(VREFH)
CHIPB_VDD_2P5V: C104.1 P71.1 U50.4(Vout)
GND: C1.2 C2.2 C3.2 C6.2 C7.2 C8.2 C9.2 C10.2 C11.2 C12.2 C14.2 C15.2 C18.2 C19.2 C20.2 C21.2 C23.2 C24.2 C25.2 C26.2 C27.2 C28.2 C29.2 C30.2 C31.2 C32.2 C33.2 C34.2 C35.2 C36.2 C37.2 C38.2 C39.2 C40.2 C41.2 C42.2 C43.2 C44.2 C45.2 C46.2 C48.2 C49.2 C50.2 C51.2 C53.2 C54.2 C55.2 C56.2 C57.2 C58.2 C60.2 C61.2 C62.2 C63.2 C85.2 C86.2 C87.2 C88.2 C89.2 C90.2 C91.2 C92.2 C93.2 C94.2 C95.2 C96.2 C98.2 C99.2 C100.2 C101.2 C103.2 C104.2 C105.2 C106.2 C107.2 C108.2 C110.2 C111.2 C112.2 C113.2 C115.2 C118.2 C119.2 C120.2 C122.2 C123.2 C126.2 C127.2 C128.2 C129.2 C131.2 C132.2 J1.1 J2.1 J3.1 J4.1 J5.1 J6.1 J7.1 J8.1 J12.1 J17.1(SHIELD) J19.1(SHIELD) J21.1(SHIELD) J22.2 J22.3 J22.4 J22.5 J24.1(SHIELD) J27.2 J27.3 J27.4 J27.5 J30.36 J30.38 J30.40 J30.S1(SHIELD) J30.S2(SHIELD) J32.36 J32.38 J32.40 J32.S1(SHIELD) J32.S2(SHIELD) J33.73 J33.74 J33.75 J33.76 J33.77 J33.78 J33.79 J33.80 J33.81 J33.82 J33.83 J33.84 J33.85 J33.86 J33.87 J33.88 J33.89 J33.90 J33.91 J33.92 J33.93 J33.94 J33.95 J33.96 J34.C01 J34.C04 J34.C05 J34.C08 J34.C09 J34.C12 J34.C13 J34.C16 J34.C17 J34.C20 J34.C21 J34.C24 J34.C25 J34.C28 J34.C29 J34.C32 J34.C33 J34.C36 J34.C38 J34.C40 J34.D02 J34.D03 J34.D06 J34.D07 J34.D10 J34.D13 J34.D16 J34.D19 J34.D22 J34.D25 J34.D28 J34.D37 J34.D39 J34.G01 J34.G04 J34.G05 J34.G08 J34.G11 J34.G14 J34.G17 J34.G20 J34.G23 J34.G26 J34.G29 J34.G32 J34.G35 J34.G38 J34.G40 J34.H03 J34.H06 J34.H09 J34.H12 J34.H15 J34.H18 J34.H21 J34.H24 J34.H27 J34.H30 J34.H33 J34.H36 J34.H39 J36.1 J37.1 J38.1 J39.1 J40.1 J41.1 J42.1 P3.2 P6.1 P7.1 P8.1 P11.2 P13.2 P23.2 P24.2 P26.2 P29.2 P34.2 P37.2 P42.2 P45.2 P48.2 P77.1 P78.1 P79.1 P80.2 P81.2 P82.2 P88.2 R15.1 R16.1 R17.1 R18.1 R20.1 R85.2 U1.5(GND) U1.7(GND) U2.5(GND) U2.7(GND) U4.5(GND) U4.7(GND) U5.5(GND) U5.7(GND) U6.16(DGND) U7.16(DGND) U8.5(GND) U8.7(GND) U9.5(GND) U9.7(GND) U10.5(GND) U10.7(GND) U11.5(GND) U11.7(GND) U12.5(GND) U12.7(GND) U13.5(GND) U13.7(GND) U14.5(GND) U14.7(GND) U15.5(GND) U15.7(GND) U16.11(GND) U16.20(RESETSEL) U17.5(GND) U17.7(GND) U18.5(GND) U18.7(GND) U20.11(GND) U20.20(RESETSEL) U21.5(GND) U21.7(GND) U22.5(GND) U22.7(GND) U26.GND1(GND) U26.GND2(GND) U26.GND3(GND) U26.GND4(GND) U26.GND5(GND) U29.3(GND) U29.5(~ERROR) U29.6(16) U43.11(GND) U43.20(RESETSEL) U45.11(GND) U45.20(RESETSEL) U50.3(GND) U50.5(~ERROR) U50.6(16) U56.16(DGND) U57.16(DGND)
PCB_AGND: J31.1 J35.1 P5.1 P14.2 P16.2 P18.3 P20.2 P21.2 P28.2 P28.4 P28.6 P28.8 P56.3 P57.3 P58.3 P59.3 P70.2 P70.4 P70.6 P70.8 P72.3 P73.3 P74.3 P75.3 P76.1 P83.2 P84.2 P85.3 P86.2 P87.2 R8.2 R18.2 R41.2 U3.6(VS-) U16.4(VREFL) U16.10(VSS) U19.3(GND) U20.4(VREFL) U20.10(VSS) U24.2(GND) U27.2(GND) U30.2(GND) U32.2(GND) U43.4(VREFL) U43.10(VSS) U44.3(GND) U45.4(VREFL) U45.10(VSS) U46.2(GND) U48.2(GND) U51.2(GND) U53.2(GND) U55.6(VS-)
PCB_DGND: C65.2 C66.2 C67.2 C68.2 C69.2 C70.2 C71.2 C72.2 C73.2 C74.2 C75.2 C76.2 C77.2 C78.2 C79.2 C80.2 C81.2 C82.2 C83.2 C84.2 R20.2 U23.3(GND) U34.3(GND) U35.3(GND) U36.3(GND) U37.3(GND) U38.3(GND) U39.3(GND) U40.3(GND) U41.3(GND) U42.3(GND)
VBIAS_2P5V: C33.1 C40.1 C45.1 C46.1 C50.1 C51.1 C57.1 C58.1 C62.1 C63.1 P55.2 R25.1 R26.1 R28.1 R29.1 U16.7(VREFH) U20.7(VREFH)
VDD_2P5V: C54.1 P55.1 U29.4(Vout)
VDD_3P3V_IN: C1.1 C2.1 C9.1 C10.1 C11.1 C12.1 C25.1 C26.1 C27.1 C28.1 C29.1 C30.1 C34.1 C35.1 C41.1 C42.1 C65.1 C66.1 C67.1 C68.1 C69.1 C70.1 C71.1 C72.1 C73.1 C74.1 C75.1 C76.1 C77.1 C78.1 C79.1 C80.1 C81.1 C82.1 C83.1 C84.1 J9.1 P3.1 U1.4(VDD) U2.4(VDD) U4.4(VDD) U5.4(VDD) U8.4(VDD) U9.4(VDD) U10.4(VDD) U11.4(VDD) U12.4(VDD) U13.4(VDD) U14.4(VDD) U15.4(VDD) U17.4(VDD) U18.4(VDD) U21.4(VDD) U22.4(VDD) U23.5(VCC) U34.5(VCC) U35.5(VCC) U36.5(VCC) U37.5(VCC) U38.5(VCC) U39.5(VCC) U40.5(VCC) U41.5(VCC) U42.5(VCC)
VDD_5V_IN: C6.1 C7.1 C8.1 C18.1 C20.1 C23.1 C24.1 C31.1 C32.1 C36.1 C37.1 C38.1 C39.1 C43.1 C44.1 C48.1 C49.1 C53.1 C55.1 C56.1 C60.1 C61.1 C85.1 C86.1 C88.1 C89.1 C90.1 C91.1 C93.1 C94.1 C98.1 C99.1 C103.1 C105.1 C106.1 C110.1 C111.1 C118.1 C119.1 C120.1 C126.1 C128.1 C131.1 C132.1 J10.1 P6.3 P7.3 P8.3 P11.1 P77.3 P78.3 P79.3 R27.2 R32.2 U3.3(VS+) U3.7(*PD) U6.6(VS+) U6.7(LVDD) U7.6(VS+) U7.7(LVDD) U16.1(VDD) U19.1(VIN) U20.1(VDD) U24.5(VDD) U27.5(VDD) U29.2(Vin) U30.5(VDD) U32.5(VDD) U43.1(VDD) U44.1(VIN) U45.1(VDD) U46.5(VDD) U48.5(VDD) U50.2(Vin) U51.5(VDD) U53.5(VDD) U55.3(VS+) U55.7(*PD) U56.6(VS+) U56.7(LVDD) U57.6(VS+) U57.7(LVDD) VDD_1.A
VNEG: C14.1 C15.1 C19.1 C21.1 C122.1 C123.1 C127.1 C129.1 J11.1 P13.1 U6.14(LVSS) U6.15(VS-) U6.17(EPAD) U7.14(LVSS) U7.15(VS-) U7.17(EPAD) U56.14(LVSS) U56.15(VS-) U56.17(EPAD) U57.14(LVSS) U57.15(VS-) U57.17(EPAD)
A0: P8.2 U6.4(A0) U7.4(A0)
A1: P7.2 U6.5(A1) U7.5(A1)
A2: P6.2 U6.1(A2) U7.1(A2)
ACK: J33.5 P60.2 U34.4(Y)
ACK_EXT: J34.C11 P60.1 U26.1(TX1) U34.2(A)
ADDRX0: J33.14 P65.1 U38.2(A)
ADDRX0_EXT: J34.C18 P65.2 U26.4(BCLK2) U38.4(Y)
ADDRY0: J33.17 P64.1 U37.2(A)
ADDRY0_EXT: J34.C19 P64.2 U26.5(IN2) U37.4(Y)
AER_DIS: J33.20 J34.C22 U26.6(OUT1D)
AGND_VCM: P89.2 U2.3(CN) U8.3(CN) U9.3(CN) U12.3(CN) U13.3(CN) U15.3(CN) U18.3(CN) U22.3(CN)
CHIPA_ACK: J30.37 J33.4
CHIPA_ADDRX0: J30.25 J33.13
CHIPA_ADDRY0: J30.23 J33.16
CHIPA_AER_DIS: J30.21 J33.19
CHIPA_CATTN_SCL: U2.6(SCL) U9.6(SCL) U12.6(SCL) U18.6(SCL) U26.40(A16)
CHIPA_CATTN_SDA: U2.1(SDA) U9.1(SDA) U12.1(SDA) U18.1(SDA) U26.39(A15)
CHIPA_CATTP_SCL: U8.6(SCL) U13.6(SCL) U15.6(SCL) U22.6(SCL) U26.38(A14)
CHIPA_CATTP_SDA: U8.1(SDA) U13.1(SDA) U15.1(SDA) U22.1(SDA) U26.37(CS3)
CHIPA_CLK: J22.1 J30.11
CHIPA_CSb_IDAC: J33.55 U20.14(*CS)
CHIPA_CSb_VDAC: J33.52 U16.14(*CS)
CHIPA_CT_MODE: J30.15 J33.28
CHIPA_DIG_RES0: J30.7 J33.34
CHIPA_DIG_RES1: J30.5 J33.37
CHIPA_DIG_RES2: J30.3 J33.40
CHIPA_DIG_RES3: J30.1 J33.43
CHIPA_GAIN_HI: J30.13 J33.31
CHIPA_IBIAS: J30.12 P59.2
CHIPA_IBIAS_ADAPT: J30.10 P58.2
CHIPA_IBIAS_ADAPT_PRE: P58.1 U31.3(COLLECTOR)
CHIPA_IBIAS_AFE: J30.8 P57.2
CHIPA_IBIAS_AFE_PRE: P57.1 U28.3(COLLECTOR)
CHIPA_IBIAS_PRE: P59.1 U33.3(COLLECTOR)
CHIPA_IBIAS_SLEW: J30.6 P56.2
CHIPA_IBIAS_SLEW_PRE: P56.1 U25.3(COLLECTOR)
CHIPA_LDACb: J33.49 U16.18(*LOADDACS) U20.18(*LOADDACS)
CHIPA_RATIOMODE0: J30.19 J33.22
CHIPA_RATIOMODE1: J30.17 J33.25
CHIPA_REQOFF: J30.33 J33.10
CHIPA_REQON: J30.35 J33.7
CHIPA_RESETb: J33.46 U16.19(*RESET) U20.19(*RESET)
CHIPA_RST: J30.39 J33.1
CHIPA_SCLK: J33.58 U16.13(CLK) U20.13(CLK)
CHIPA_SDI: J33.61 U16.12(SDI) U20.12(SDI)
CHIPA_VBIAS: U20.3(VOUTC) U32.3(IN+)
CHIPA_VBIAS_ADAPT: U20.2(VOUTD) U30.3(IN+)
CHIPA_VBIAS_AFE: U20.8(VOUTB) U27.3(IN+)
CHIPA_VBIAS_SLEW: U20.9(VOUTA) U24.3(IN+)
CHIPA_VCM: J16.1 J16.3 J16.5 J16.7 J16.9 J16.11 J16.13 J16.14 J16.15 J16.17 J16.18 J16.22 J16.23 J16.26 J16.27 J16.33 J16.34 J16.40 J16.S1(SHIELD) J16.S2(SHIELD) J30.30 P1.2(Y) P2.2(Y) P4.2(Y) P9.2(Y) P10.2(Y) P12.2(Y) P15.2(Y) P17.2(Y) P18.1 P19.2(Y) P22.2(Y) P25.2(Y) P27.2(Y) P28.1 P38.2(Y) P41.2(Y) P51.2(Y) P54.2(Y) P89.1 U16.9(VOUTA)
CHIPA_VD: J30.4 J33.70
CHIPA_VG: J30.2 J33.67
CHIPA_VIN_SINGLEEND_OTA: J1.2 R5.2 R8.1
CHIPA_VINN_REPLICA: J3.2 J16.4 R1.2
CHIPA_VINN_X0: J16.20 P12.1(X) U5.3(CN)
CHIPA_VINN_X1: J16.39 P19.1(X) U10.3(CN)
CHIPA_VINN_Y0: J16.32 P41.1(X) U17.3(CN)
CHIPA_VINN_Y1: J16.25 P2.1(X) U1.3(CN)
CHIPA_VINP_REPLICA: J2.2 J16.2 R2.2
CHIPA_VINP_X0: J16.28 P22.1(X) U11.3(CN)
CHIPA_VINP_X1: J16.37 P27.1(X) U14.3(CN)
CHIPA_VINP_Y0: J16.30 P54.1(X) U21.3(CN)
CHIPA_VINP_Y1: J16.35 P9.1(X) U4.3(CN)
CHIPA_VN_X0: J16.16 P10.1(X) R14.2 U5.2(CP)
CHIPA_VN_X1: J16.19 P15.1(X) R19.2 U10.2(CP)
CHIPA_VN_Y0: J16.38 P38.1(X) R23.2 U17.2(CP)
CHIPA_VN_Y1: J16.29 P1.1(X) R3.2 U1.2(CP)
CHIPA_VOUTN_REPLICA: J16.6 P21.1 R9.2
CHIPA_VOUTN_REPLICA_INAMP: C16.2 J5.2 U6.10(OUT+)
CHIPA_VOUTN_X0: J16.10 P20.1 R12.2
CHIPA_VOUTN_X0_INAMP: C22.2 J7.2 U7.10(OUT+)
CHIPA_VOUTP_REPLICA: J16.8 P16.1 R10.2
CHIPA_VOUTP_REPLICA_INAMP: C13.1 J4.2 U6.11(OUT-)
CHIPA_VOUTP_X0: J16.12 P14.1 R13.2
CHIPA_VOUTP_X0_INAMP: C17.1 J6.2 U7.11(OUT-)
CHIPA_VP_X0: J16.24 P17.1(X) R21.2 U11.2(CP)
CHIPA_VP_X1: J16.21 P25.1(X) R22.2 U14.2(CP)
CHIPA_VP_Y0: J16.36 P51.1(X) R24.2 U21.2(CP)
CHIPA_VP_Y1: J16.31 P4.1(X) R11.2 U4.2(CP)
CHIPA_VS: J30.9 J33.64
CHIPA_VTRIG_COMP: J30.14 P28.5 U16.3(VOUTC)
CHIPA_VTUNE_PSEUDO: J30.16 P28.3 U16.8(VOUTB)
CHIPA_X0_CSN_SCL: U5.6(SCL) U26.36(CS2)
CHIPA_X0_CSN_SDA: U5.1(SDA) U26.35(TX8)
CHIPA_X0_CSP_SCL: U11.6(SCL) U26.34(RX8)
CHIPA_X0_CSP_SDA: U11.1(SDA) U26.33(MCLK2)
CHIPA_X1_CSN_SCL: U10.6(SCL) U26.32(OUT1B)
CHIPA_X1_CSN_SDA: U10.1(SDA) U26.31(CTX3)
CHIPA_X1_CSP_SCL: U14.6(SCL) U26.30(CRX3)
CHIPA_X1_CSP_SDA: U14.1(SDA) U26.29(TX7)
CHIPA_Y0_CSN_SCL: U17.6(SCL) U26.28(RX7)
CHIPA_Y0_CSN_SDA: U17.1(SDA) U26.27(A13)
CHIPA_Y0_CSP_SCL: U21.6(SCL) U26.26(A12)
CHIPA_Y0_CSP_SDA: U21.1(SDA) U26.25(A11)
CHIPA_Y1_CSN_SCL: U1.6(SCL) U26.24(A10)
CHIPA_Y1_CSN_SDA: U1.1(SDA) U26.23(A9)
CHIPA_Y1_CSP_SCL: U4.6(SCL) U26.22(A8)
CHIPA_Y1_CSP_SDA: U4.1(SDA) U26.21(A7)
CHIPB_A0: P79.2 U56.4(A0) U57.4(A0)
CHIPB_A1: P78.2 U56.5(A1) U57.5(A1)
CHIPB_A2: P77.2 U56.1(A2) U57.1(A2)
CHIPB_ACK: J32.37 J33.6
CHIPB_ADDRX0: J32.25 J33.15
CHIPB_ADDRY0: J32.23 J33.18
CHIPB_AER_DIS: J32.21 J33.21
CHIPB_CLK: J27.1 J32.11
CHIPB_CSb_IDAC: J33.57 U45.14(*CS)
CHIPB_CSb_VDAC: J33.54 U43.14(*CS)
CHIPB_CT_MODE: J32.15 J33.30
CHIPB_DIG_RES0: J32.7 J33.36
CHIPB_DIG_RES1: J32.5 J33.39
CHIPB_DIG_RES2: J32.3 J33.42
CHIPB_DIG_RES3: J32.1 J33.45
CHIPB_GAIN_HI: J32.13 J33.33
CHIPB_IBIAS: J32.12 P75.2
CHIPB_IBIAS_ADAPT: J32.10 P74.2
CHIPB_IBIAS_ADAPT_PRE: P74.1 U52.3(COLLECTOR)
CHIPB_IBIAS_AFE: J32.8 P73.2
CHIPB_IBIAS_AFE_PRE: P73.1 U49.3(COLLECTOR)
CHIPB_IBIAS_PRE: P75.1 U54.3(COLLECTOR)
CHIPB_IBIAS_SLEW: J32.6 P72.2
CHIPB_IBIAS_SLEW_PRE: P72.1 U47.3(COLLECTOR)
CHIPB_LDACb: J33.51 U43.18(*LOADDACS) U45.18(*LOADDACS)
CHIPB_RATIOMODE0: J32.19 J33.24
CHIPB_RATIOMODE1: J32.17 J33.27
CHIPB_REQOFF: J32.33 J33.12
CHIPB_REQON: J32.35 J33.9
CHIPB_RESETb: J33.48 U43.19(*RESET) U45.19(*RESET)
CHIPB_RST: J32.39 J33.3
CHIPB_SCLK: J33.60 U43.13(CLK) U45.13(CLK)
CHIPB_SDI: J33.63 U43.12(SDI) U45.12(SDI)
CHIPB_VBIAS: U45.3(VOUTC) U53.3(IN+)
CHIPB_VBIAS_ADAPT: U45.2(VOUTD) U51.3(IN+)
CHIPB_VBIAS_AFE: U45.8(VOUTB) U48.3(IN+)
CHIPB_VBIAS_SLEW: U45.9(VOUTA) U46.3(IN+)
CHIPB_VCM: J23.1 J23.3 J23.5 J23.7 J23.9 J23.11 J23.13 J23.14 J23.15 J23.17 J23.18 J23.22 J23.23 J23.26 J23.27 J23.33 J23.34 J23.40 J23.S1(SHIELD) J23.S2(SHIELD) J32.30 P30.2(Y) P31.2(Y) P32.2(Y) P33.2(Y) P35.2(Y) P36.2(Y) P39.2(Y) P40.2(Y) P43.2(Y) P44.2(Y) P46.2(Y) P47.2(Y) P49.2(Y) P50.2(Y) P52.2(Y) P53.2(Y) P70.1 P85.1 U43.9(VOUTA)
CHIPB_VD: J32.4 J33.72
CHIPB_VG: J32.2 J33.69
CHIPB_VIN_SINGLEEND_OTA: J36.2 R38.2 R41.1
CHIPB_VINN_REPLICA: J23.4 J38.2 R35.2
CHIPB_VINN_X0: J23.20 P50.1(X)
CHIPB_VINN_X1: J23.39 P36.1(X)
CHIPB_VINN_Y0: J23.32 P49.1(X)
CHIPB_VINN_Y1: J23.25 P35.1(X)
CHIPB_VINP_REPLICA: J23.2 J37.2 R36.2
CHIPB_VINP_X0: J23.28 P53.1(X)
CHIPB_VINP_X1: J23.37 P40.1(X)
CHIPB_VINP_Y0: J23.30 P52.1(X)
CHIPB_VINP_Y1: J23.35 P39.1(X)
CHIPB_VN_X0: J23.16 P44.1(X)
CHIPB_VN_X1: J23.19 P31.1(X)
CHIPB_VN_Y0: J23.38 P43.1(X)
CHIPB_VN_Y1: J23.29 P30.1(X)
CHIPB_VOUTN_REPLICA: J23.6 P87.1 R42.2
CHIPB_VOUTN_REPLICA_INAMP: C124.2 J40.2 U56.10(OUT+)
CHIPB_VOUTN_X0: J23.10 P86.1 R44.2
CHIPB_VOUTN_X0_INAMP: C130.2 J42.2 U57.10(OUT+)
CHIPB_VOUTP_REPLICA: J23.8 P84.1 R43.2
CHIPB_VOUTP_REPLICA_INAMP: C121.1 J39.2 U56.11(OUT-)
CHIPB_VOUTP_X0: J23.12 P83.1 R45.2
CHIPB_VOUTP_X0_INAMP: C125.1 J41.2 U57.11(OUT-)
CHIPB_VP_X0: J23.24 P47.1(X)
CHIPB_VP_X1: J23.21 P33.1(X)
CHIPB_VP_Y0: J23.36 P46.1(X)
CHIPB_VP_Y1: J23.31 P32.1(X)
CHIPB_VREF_2P5V: P71.3 U44.2(VOUT)
CHIPB_VS: J32.9 J33.66
CHIPB_VTRIG_COMP: J32.14 P70.5 U43.3(VOUTC)
CHIPB_VTUNE_PSEUDO: J32.16 P70.3 U43.8(VOUTB)
CSb_IDAC: J33.56 J34.D20 U26.18(A4)
CSb_VDAC: J33.53 J34.D18 U26.17(A3)
CT_MODE: J33.29 J34.C27 U26.9(OUT1C)
DGND: J30.24 J32.24 R17.2
DIG_RES0: J33.35 P66.1 U39.2(A)
DIG_RES0_EXT: J34.D09 P66.2 U26.11(MOSI) U39.4(Y)
DIG_RES1: J33.38 P67.1 U40.2(A)
DIG_RES1_EXT: J34.D11 P67.2 U26.12(MISO) U40.4(Y)
DIG_RES2: J33.41 P68.1 U41.2(A)
DIG_RES2_EXT: J34.D12 P68.2 U26.13(SCK) U41.4(Y)
DIG_RES3: J33.44 P69.1 U42.2(A)
DIG_RES3_EXT: J34.D14 P69.2 U26.14(A0) U42.4(Y)
FPGA_3P3V: J34.C39 P82.1
FPGA_12V: J34.C35 P81.1
FPGA_TEST0: J34.H07 P80.1
FPGA_VADJ: J34.G39 P88.1
GAIN_HI: J33.32 J34.D08 U26.10(CS1)
LDACb: J33.50 J34.D17 U26.16(A2)
RATIOMODE0: J33.23 J34.C23 U26.7(RX2)
RATIOMODE1: J33.26 J34.C26 U26.8(TX2)
REQOFF: J33.11 P63.1 U36.2(A)
REQOFF_EXT: J34.C15 P63.2 U26.3(LRCLK2) U36.4(Y)
REQON: J33.8 P62.1 U35.2(A)
REQON_EXT: J34.C14 P62.2 U26.2(OUT2) U35.4(Y)
RESETb: J33.47 J34.D15 U26.15(A1)
RST: J33.2 P61.2 U23.4(Y)
RST_EXT: J34.C10 P61.1 U23.2(A) U26.0(RX1)
SCLK: J33.59 J34.D21 U26.19(A5)
SDI: J33.62 J34.D23 U26.20(A6)
VD: J26.1 J33.71 P42.1
VDAC_RESERVED0: P28.7 U16.2(VOUTD)
VDAC_RESERVED1: P70.7 U43.2(VOUTD)
VDD_ADC_3V: J20.1 J30.32 J32.32 P34.1
VDD_AFE_3V: J25.1 J30.34 J32.34 P37.1
VDD_DIG_3V: J15.1 J30.18 J32.18 P26.1
VDD_DIG_6V: J13.1 J30.22 J30.27 J32.22 J32.27 P23.1
VDD_IO_3P3V: J14.1 J30.31 J32.31 P24.1
VDD_TDIG_3V: J18.1 J30.26 J32.26 P29.1
VG: J28.1 J33.68 P45.1
VOCM_IN: C3.1 C115.1 J8.2 P5.3 P76.3 U3.2(VOCM) U55.2(VOCM)
VREF_2P5V: P55.3 U19.2(VOUT)
VS: J29.1 J33.65 P48.1
VSS: J30.20 J30.29 J32.20 J32.29 R15.2
NetC4_1: C4.1 R4.2 R7.1 U3.8(VIN+)
NetC4_2: C4.2 R1.1 R7.2 U3.5(VOUT-)
NetC5_1: C5.1 R5.1 R6.1 U3.1(VIN-)
NetC5_2: C5.2 R2.1 R6.2 U3.4(VOUT+)
NetC13_2: C13.2 U6.12(FDA_IN+)
NetC16_1: C16.1 U6.9(FDA_IN-)
NetC17_2: C17.2 U7.12(FDA_IN+)
NetC22_1: C22.1 U7.9(FDA_IN-)
NetC47_1: C47.1 R25.2 U24.4(IN-) U25.2(EMITTER)
NetC47_2: C47.2 U24.1(OUT) U25.1(BASE)
NetC52_1: C52.1 R26.2 U27.4(IN-) U28.2(EMITTER)
NetC52_2: C52.2 U27.1(OUT) U28.1(BASE)
NetC59_1: C59.1 R28.2 U30.4(IN-) U31.2(EMITTER)
NetC59_2: C59.2 U30.1(OUT) U31.1(BASE)
NetC64_1: C64.1 R29.2 U32.4(IN-) U33.2(EMITTER)
NetC64_2: C64.2 U32.1(OUT) U33.1(BASE)
NetC97_1: C97.1 R30.2 U46.4(IN-) U47.2(EMITTER)
NetC97_2: C97.2 U46.1(OUT) U47.1(BASE)
NetC102_1: C102.1 R31.2 U48.4(IN-) U49.2(EMITTER)
NetC102_2: C102.2 U48.1(OUT) U49.1(BASE)
NetC109_1: C109.1 R33.2 U51.4(IN-) U52.2(EMITTER)
NetC109_2: C109.2 U51.1(OUT) U52.1(BASE)
NetC114_1: C114.1 R34.2 U53.4(IN-) U54.2(EMITTER)
NetC114_2: C114.2 U53.1(OUT) U54.1(BASE)
NetC116_1: C116.1 R37.2 R40.1 U55.8(VIN+)
NetC116_2: C116.2 R35.1 R40.2 U55.5(VOUT-)
NetC117_1: C117.1 R38.1 R39.1 U55.1(VIN-)
NetC117_2: C117.2 R36.1 R39.2 U55.4(VOUT+)
NetC121_2: C121.2 U56.12(FDA_IN+)
NetC124_1: C124.1 U56.9(FDA_IN-)
NetC125_2: C125.2 U57.12(FDA_IN+)
NetC130_1: C130.1 U57.9(FDA_IN-)
NetP5_2: P5.2 R4.1
NetP18_2: P18.2 U6.13(VOCM) U7.13(VOCM)
NetP76_2: P76.2 R37.1
NetP85_2: P85.2 U56.13(VOCM) U57.13(VOCM)
NetR3_1: R3.1 U2.2(CP)
NetR9_1: R9.1 U6.2(IN+)
NetR10_1: R10.1 U6.3(IN-)
NetR11_1: R11.1 U8.2(CP)
NetR12_1: R12.1 U7.2(IN+)
NetR13_1: R13.1 U7.3(IN-)
NetR14_1: R14.1 U9.2(CP)
NetR19_1: R19.1 U12.2(CP)
NetR21_1: R21.1 U13.2(CP)
NetR22_1: R22.1 U15.2(CP)
NetR23_1: R23.1 U18.2(CP)
NetR24_1: R24.1 U22.2(CP)
NetR27_1: R27.1 U29.1(~SD)
NetR32_1: R32.1 U50.1(~SD)
NetR42_1: R42.1 U56.2(IN+)
NetR43_1: R43.1 U56.3(IN-)
NetR44_1: R44.1 U57.2(IN+)
NetR45_1: R45.1 U57.3(IN-)
NetR85_1: R85.1 VDD_1.K

Not connected (* = marked no-connect by the designer): J34 C02 C03 C06 C07 C30 C31 C34 C37 D01 D04 D05 D24 D26 D27 D29 D30 D31 D32 D33 D34 D35 D36 D38 D40 G02 G03 G06 G07 G09 G10 G12 G13 G15 G16 G18 G19 G21 G22 G24 G25 G27 G28 G30 G31 G33 G34 G36 G37 H01 H02 H04 H05 H08 H10 H11 H13 H14 H16 H17 H19 H20 H22 H23 H25 H26 H28 H29 H31 H32 H34 H35 H37 H38 H40; U6 8(NC); U7 8(NC); U16 5(NIC) 6(NIC) 15(NIC) 16(NIC) 17(NIC); U20 5(NIC) 6(NIC) 15(NIC) 16(NIC) 17(NIC); U23 1(NC); U26 3.3V_1(3.3V) 3.3V_2(3.3V) 3.3V_3(3.3V) 5V 41(A17) D+ D- LED ON/OFF PROGRAM R+ R- T+ T- USB_GND1(USB_GND) USB_GND2(USB_GND) VBAT VIN VUSB; U34 1(NC); U35 1(NC); U36 1(NC); U37 1(NC); U38 1(NC); U39 1(NC); U40 1(NC); U41 1(NC); U42 1(NC); U43 5(NIC) 6(NIC) 15(NIC) 16(NIC) 17(NIC); U45 5(NIC) 6(NIC) 15(NIC) 16(NIC) 17(NIC); U56 8(NC); U57 8(NC)

## Notes on the sheet
- (near J8) VOCM_IN to test CMRR
- 50ohm matching
- (near R1) 0ohm resistor to disconnect input buffer -> direct differential connection to chip OTA
- Optional noise filtering -> desolder if problematic
- (near R35) 0ohm resistor to disconnect input buffer -> direct differential connection to chip OTA
- (near P77) By default, connect to PCB_AGND
  VOCM_IN is for backup
- No need for negative supply -> input can go from -0.1V to 3.6V
  Remember: VP/VN is shifted high due to VOCM in Vout (check sloa054e.pdf)
- (near P6) By default, connect to PCB_AGND
  VOCM_IN is for backup
- Interchanged inputs for layout reasons; output interchanged to match
- Input voltage range from VS- + 2.5V to VS+ - 2.5V
- By default, connect to CHIPA_VCM
- Due to lack of space for BNC connectors, headers are placed -> can be connected with header to BNC
- By default, connect to VDD_2P5V (proven to work). Option to VREF for better accuracy
- (near J32) By default, connect to VDD_2P5V (proven to work). Option to VREF for better accuracy
- (near P72) By default, connect to IDAC output. Otherwise, connect external IBIAS (GND pin for eaasy connection)
- (near P56) By default, connect to IDAC output. Otherwise, connect external IBIAS (GND pin for eaasy connection)
- Nets unconnected to GND (due to layout constraints)
  - H36/G35
- (near P73) By default, connect to IDAC output. Otherwise, connect external IBIAS (GND pin for eaasy connection)
- (near P57) By default, connect to IDAC output. Otherwise, connect external IBIAS (GND pin for eaasy connection)
- To test 12V FPGA
- (near P82) To test 3.3V FPGA
- (near P58) By default, connect to IDAC output. Otherwise, connect external IBIAS (GND pin for eaasy connection)
- (near P74) By default, connect to IDAC output. Otherwise, connect external IBIAS (GND pin for eaasy connection)
- (near P88) To test VADJ FPGA
- (near P59) By default, connect to IDAC output. Otherwise, connect external IBIAS (GND pin for eaasy connection)
- (near P75) By default, connect to IDAC output. Otherwise, connect external IBIAS (GND pin for eaasy connection)
- Labels drawn without touching a wire or pin: CHIPA_CATTN_SCL, CHIPA_CATTN_SDA, CHIPA_CATTP_SCL, CHIPA_CATTP_SDA, CHIPA_X0_CSN_SCL, CHIPA_X0_CSN_SDA, CHIPA_X0_CSP_SCL, CHIPA_X0_CSP_SDA, CHIPA_X1_CSN_SCL, CHIPA_X1_CSN_SDA, CHIPA_X1_CSP_SCL, CHIPA_X1_CSP_SDA, CHIPA_Y0_CSN_SCL, CHIPA_Y0_CSN_SDA, CHIPA_Y0_CSP_SCL, CHIPA_Y0_CSP_SDA, CHIPA_Y1_CSN_SCL, CHIPA_Y1_CSN_SDA, CHIPA_Y1_CSP_SCL, CHIPA_Y1_CSP_SDA
- Title
- Size:
- Date:
- File:
- A0
- Number:
- Time:
- Revision:
- Sheet
- of
- (in symbol C3216X5R1A686M160AC) +
- (in symbol C4532X7R1C336M250KC) +

## Library data of the parts
C1 C6 C9 C11 C14 C18 C19 C23 C25 C27 C29 C31 C33 C34 C36 C38 C40 C41 C43 C45 C48 C50 C55 C57 C60 C62 C69-C72 C75 C76 C79 C80 C83-C85 C87 C88 C90 C92 C93 C95 C98 C100 C105 C107 C110 C112 C118 C122 C126 C127 C131 = CAPC_100n_0603: Capacitor SMD Cer 100nF 10% 50V X7R 0603; Manufacturer 1: AVX Corporation; Manufacturer Part Number 1: 06035C104KAT2A; Ratings: 50V; X7R; Material: ceramic; Manufacturer 2: TDK Corporation; Manufacturer Part Number 2: C1608X7R1H104K; Package / Case: 0603 (1608 Metric); Tolerance: ±10%; Supplier 1: Digi-Key; Supplier Part Number 1: 478-5052-1-ND; ComponentLink1URL: http://www.avx.com/docs/Catalogs/cx7r.pdf; ComponentLink1Description: http://www.avx.com/docs/Catalogs/cx7r.pdf; Supplier 2: Digi-Key; Supplier Part Number 2: 445-1314-1-ND; ComponentLink2URL: http://product.tdk.com/capacitor/mlcc/en/documents/mlcc_commercial_general_en.pdf; ComponentLink2Description: http://product.tdk.com/capacitor/mlcc/en/documents/mlcc_commercial_general_en.pdf
C2 C7 C10 C12 C15 C20 C21 C24 C26 C28 C30 C32 C35 C37 C39 C42 C44 C46 C49 C51 C56 C58 C61 C63 C65-C68 C73 C74 C77 C78 C81 C82 C86 C89 C91 C94 C96 C99 C101 C106 C108 C111 C113 C119 C123 C128 C129 C132 = CAPT_10u_0805_10V: Capacitor SMD Tantalum 10uF 20% 10V 0805; Manufacturer 1: AVX Corporation; Manufacturer Part Number 1: TAJP106M010RNJ; Package / Case: 0805 (2012 metric); Tolerance: ±20%; Material: Tantalum; Supplier 1: Digi-Key; Supplier Part Number 1: 478-3281-1-ND; Value: 10µ
C3 C8 C115 C120 = C0603C221K5RACTU: No Description Available; Mfr_Name: Kemet
C4 C5 C116 C117 = CML0805C0G150JT50V: No Description Available; Mfr_Name: Stackpole International
C13 C16 C17 C22 C121 C124 C125 C130 = CML0805C0G3R0CT50V: No Description Available; Mfr_Name: Stackpole International
C47 C52 C59 C64 C97 C102 C109 C114 = CAPC_47p_0603: Capacitor SMD Cer 47pF 0603; Ratings: 50V; NP0; Operating Temperature: -55°C ~ 125°C; Package / Case: 0603 (1608 Metric); Size / Dimension: 0.063" L x 0.031" W (1.60mm x 0.80mm); Thickness (Max): 0.037" (0.95mm); ComponentLink1URL: http://www.avx.com/docs/Catalogs/ccog.pdf; ComponentLink1Description: http://www.avx.com/docs/Catalogs/ccog.pdf; ComponentLink2URL: http://www.tdk.com/pdf/tight_tol_B11.pdf; ComponentLink2Description: http://www.tdk.com/pdf/tight_tol_B11.pdf; ComponentLink3URL: http://www.kemet.com/datasheets&C0603C221F5GACTU; ComponentLink3Description: http://www.kemet.com/datasheets&C0603C221F5GACTU; Value: 47p
C53 C103 = C3216X5R1A686M160AC: No Description Available; Mfr_Name: TDK; Type: DEV; Copyright: Copyright (C) 2022 Ultra Librarian. All rights reserved.; Manufacturer_Part_Number: C3216X5R1A686M160AC; RefDes: RefDes
C54 C104 = C4532X7R1C336M250KC: No Description Available; Mfr_Name: TDK; Type: DEV; Copyright: Copyright (C) 2022 Ultra Librarian. All rights reserved.; Manufacturer_Part_Number: C4532X7R1C336M250KC; RefDes: RefDes
J1-J8 J36-J42 = CONBNC002: No Description Available; Mfr_Name: Linx Technologies; RefDes: RefDes; Type: Type
J9-J15 J18 J20 J25 J26 J28 J29 = FCR7350R: No Description Available; Mfr_Name: Cliff; Copyright: Copyright (C) 2022 Ultra Librarian. All rights reserved.; Manufacturer_Part_Number: FCR7350R; RefDes: RefDes; Type: DEV
J16 J23 J30 J32 = DF17(4.0)-40DP-0.5V(57): PC Board, Headers & Receptacles, hdr, fit, series, mount, pos, Connectors and Adapters, connector, header, Connectors...; Availability: Unavailable; MP: DF17(4.0)-40DP-0.5V(57); Price: None; Package: None; Value: *
J17 J19 J21 J24 = S1711-46R: RFI SHIELD CLIP TIN SMD; MF: Harwin Inc.; Purchase-URL: https://pricing.snapeda.com/search/part/S1711-46R/?ref=eda; MP: S1711-46R; SnapEDA_Link: https://www.snapeda.com/parts/S1711-46R/Harwin%20Inc./view-part/2172610/?ref=snap; Price: None; Package: None; Value: *; Availability: Warning; Check_prices: https://www.snapeda.com/parts/S1711-46R/Harwin%20Inc./view-part/2172610/?ref=eda
J22 J27 = VB335-75: No Description Available; Mfr_Name: Cinch Connectivity Solutions; Type: Coaxial Connectors(RF) Assemblies; RefDes: RefDes
J31 J35 = 901200761: No Description Available; Mfr_Name: Molex Connector Corporation; Copyright: Copyright (C) 2022 Ultra Librarian. All rights reserved.; Manufacturer_Part_Number: 901200761; RefDes: RefDes; Type: DEV
J33 = TSW-132-09-G-T: CONN HEADER 96 POS .100"; Manufacturer_Name: SAMTEC; Geometry.Height: 8.38mm; Farnell Part Number: *; Farnell Price/Stock: *; Manufacturer_Part_Number: TSW-132-09-G-T; Datasheet Link: http://suddendocs.samtec.com/catalog_english/tsw_th.pdf
J34 = ASP-127797-01: 160 Position Connector Array, Male Pins Surface Mount Gold; MF: Samtec Inc.; Package: None; Price: None; Check_prices: https://www.snapeda.com/parts/ASP-127797-01/Samtec+Inc./view-part/?ref=eda; Value: *; SnapEDA_Link: https://www.snapeda.com/parts/ASP-127797-01/Samtec+Inc./view-part/?ref=snap; MP: ASP-127797-01; Availability: In Stock; Purchase-URL: https://pricing.snapeda.com/search?q=ASP-127797-01&ref=eda
P1 P2 P4 P9 P10 P12 P15 P17 P19 P22 P25 P27 P30-P33 P35 P36 P38-P41 P43 P44 P46 P47 P49-P54 = SMB: SMB Straight Connector; LatestRevisionDate: 17-Jul-2002; LatestRevisionNote: Re-released for DXP Platform.; Publisher: Altium Limited
P3 P11 P13 P14 P16 P20 P21 P23 P24 P26 P29 P34 P37 P42 P45 P48 P60-P69 P80-P84 P86-P88 = Header 2: Header, 2-Pin; LatestRevisionDate: 17-Jul-2002; LatestRevisionNote: Re-released for DXP Platform.; Publisher: Altium Limited
P5-P8 P18 P55-P59 P71-P79 P85 P89 = Header 3: Header, 3-Pin; LatestRevisionDate: 17-Jul-2002; LatestRevisionNote: Re-released for DXP Platform.; Publisher: Altium Limited
P28 P70 = Header 4X2: Header, 4-Pin, Dual row; LatestRevisionDate: 17-Jul-2002; LatestRevisionNote: Re-released for DXP Platform.; Publisher: Altium Limited
R1-R3 R9-R14 R19 R21-R24 R35 R36 R42-R45 = RMCF0603ZT0R00: No Description Available; Mfr_Name: Stackpole International
R4 R37 = ERA6AEB1021V: No Description Available; Mfr_Name: Panasonic
R5-R7 R38-R40 = ERA-6AEB102V: No Description Available; Mfr_Name: Panasonic
R8 R41 = ERA6AEB52R3V: No Description Available; Mfr_Name: Panasonic
R15-R18 R20 = RCL06120000Z0EA: No Description Available; Mfr_Name: Vishay
R25 R30 = ERA6AEB2432V: No Description Available; Mfr_Name: Panasonic
R26 R28 R29 R31 R33 R34 = ERA6AEB2433V: No Description Available; Mfr_Name: Panasonic
R27 R32 = RES_10K_0603_1%: Resistor SMD chip 10k Ohm 0.1W 1% 0603; Manufacturer 1: Yageo; Manufacturer Part Number 1: RC0603FR-0710KL; Ratings: 1/10W; Package / Case: 0603 (1608 Metric); Supplier 1: Digi-Key; Supplier Part Number 1: 311-10.0KHRCT-ND
R85 = RES_866R_0603_1%_1: Resistor SMD chip 866 Ohm 0.1W 1% 0603; Ratings: 1/10W; Package / Case: 0603 (1608 Metric)
U1 U2 U4 U5 U8-U15 U17 U18 U21 U22 = NCD2400MTR: No Description Available; Mfr_Name: Littelfuse / IXYS; RefDes: RefDes; Type: Type
U3 U55 = THS4521IDR: No Description Available; Mfr_Name: Texas Instruments; RefDes: RefDes; Type: Type
U6 U7 U56 U57 = PGA855RGTR: No Description Available; Mfr_Name: Texas Instruments; Type: Linear; RefDes: RefDes
U16 U20 U43 U45 = DAC7614EB: No Description Available; Mfr_Name: Texas Instruments; Copyright: Copyright (C) 2022 Ultra Librarian. All rights reserved.; Manufacturer_Part_Number: DAC7614EB; RefDes: RefDes; Type: DEV
U19 U44 = ISL60002BIH325Z-T7A: No Description Available; Mfr_Name: Renesas / Intersil; RefDes: RefDes; Type: Type
U23 U34-U42 = SN74AUP1T17DCKR: No Description Available; Mfr_Name: Texas Instruments; RefDes: RefDes; Type: Type
U24 U27 U30 U32 U46 U48 U51 U53 = TLV2771CDBVR: No Description Available; Mfr_Name: Texas Instruments; Copyright: Copyright (C) 2022 Ultra Librarian. All rights reserved.; Manufacturer_Part_Number: TLV2771CDBVR; RefDes: RefDes; Type: DEV
U25 U28 U31 U33 U47 U49 U52 U54 = BC807-25WT1G: No Description Available; Mfr_Name: onsemi; RefDes: RefDes; Type: Type
U26 = DEV-16771: RT1062 Teensy 4.1 series ARM® Cortex®-M7 MPU Embedded Evaluation Board; MF: SparkFun Electronics; SnapEDA_Link: https://www.snapeda.com/parts/DEV-16771/SparkFun+Electronics/view-part/?ref=snap; Package: None; Value: *; MP: DEV-16771; Check_prices: https://www.snapeda.com/parts/DEV-16771/SparkFun+Electronics/view-part/?ref=eda
U29 U50 = LP3961ES-2.5: No Description Available; Mfr_Name: Texas Instruments; Copyright: Copyright (C) 2022 Ultra Librarian. All rights reserved.; Manufacturer_Part_Number: LP3961ES-2.5; RefDes: RefDes; Type: DEV
VDD_1 = LED_SMD_Red_0603_220mcd: LED 0603 SMD Hyper Red 630nm 220mcd 20mA; Manufacturer 1: Kingbright Corp; Manufacturer Part Number 1: APT1608SURCK; Ratings: 220 mcd; 630 nm; Voltage - Forward (Vf) Typ: 1.95V; Voltage - Forward (Vf) @ 10mA: 1.9V; Package / Case: 0603 (1608 metric); Material: AlGaInP on GaAs; Supplier 1: Digi-Key; Supplier Part Number 1: 754-1123-1-ND